# EAGLE design 612_jetracer_328_020027 (EAGLE 9.6.2)
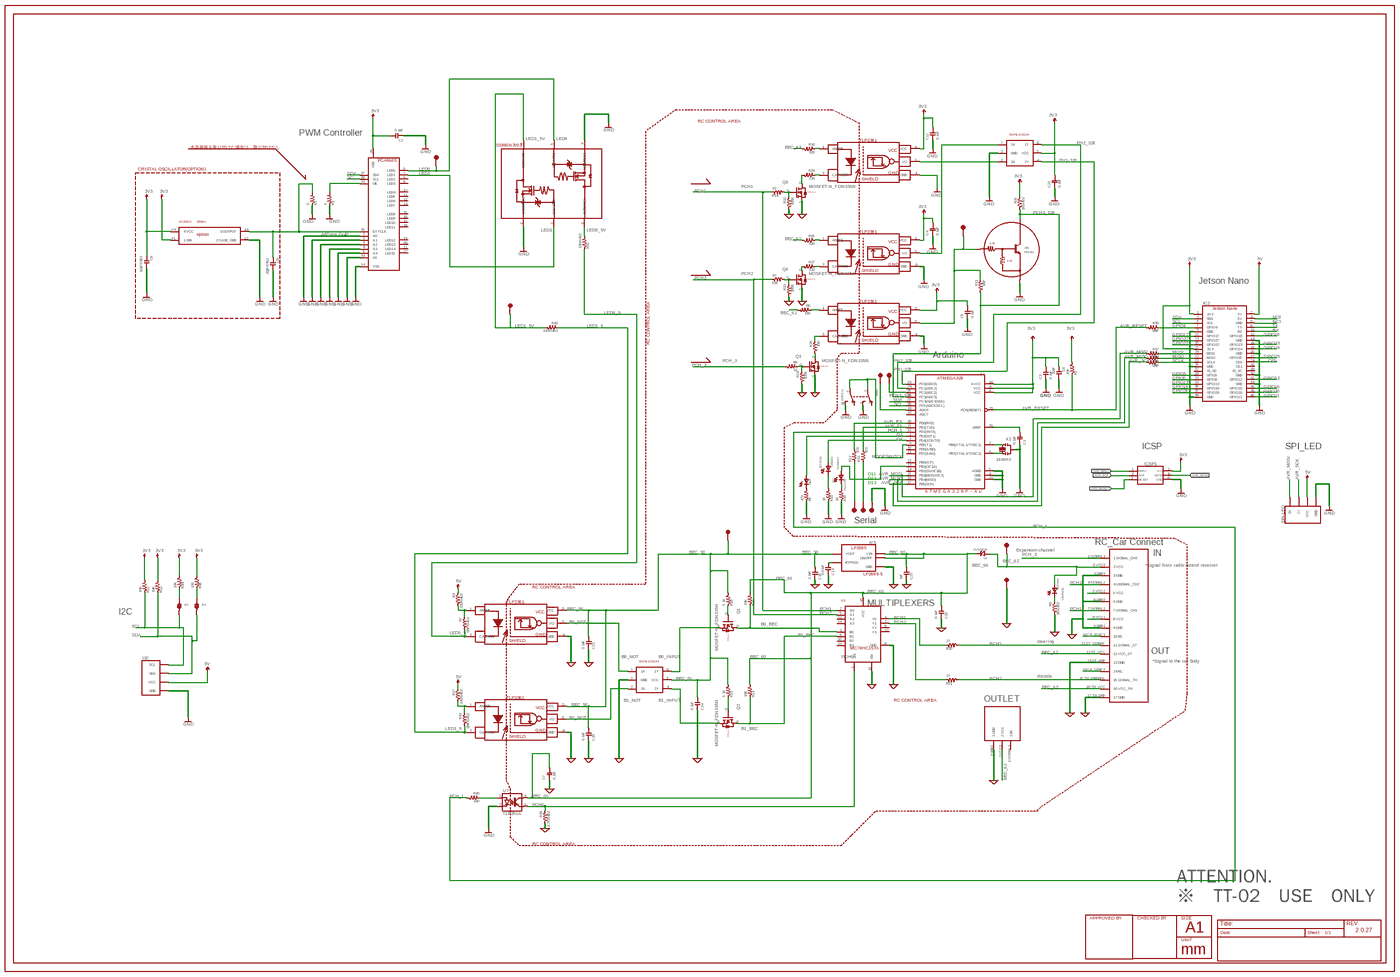
[diagram p0: schematic, sheet 1, overview]
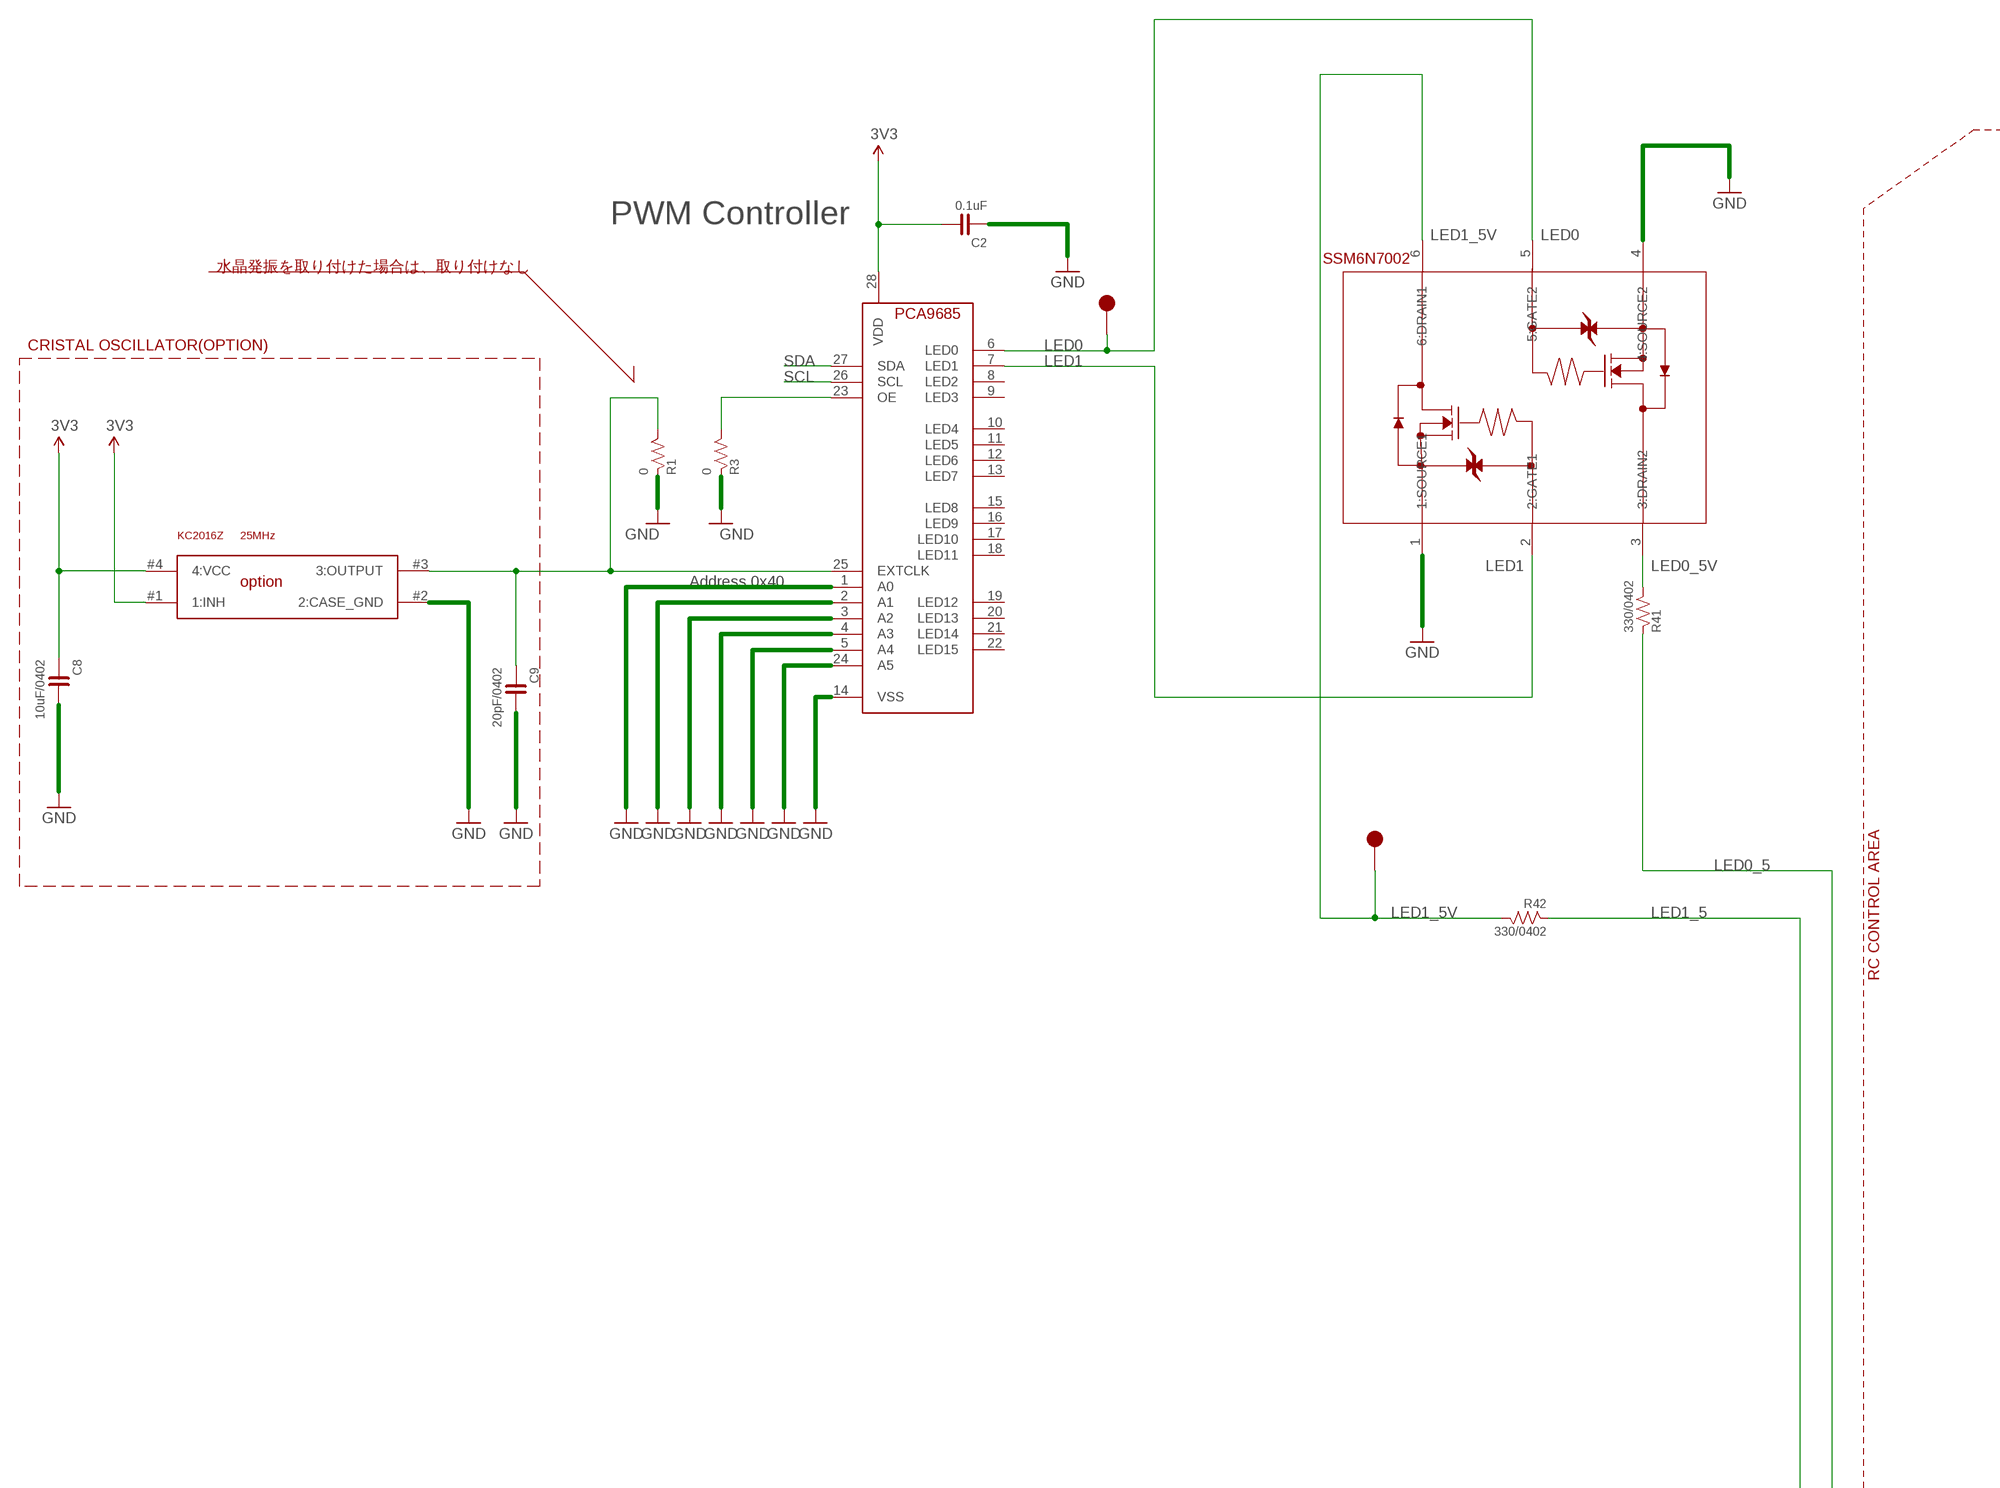
[diagram p1: schematic, sheet 1, part 1 of 4]
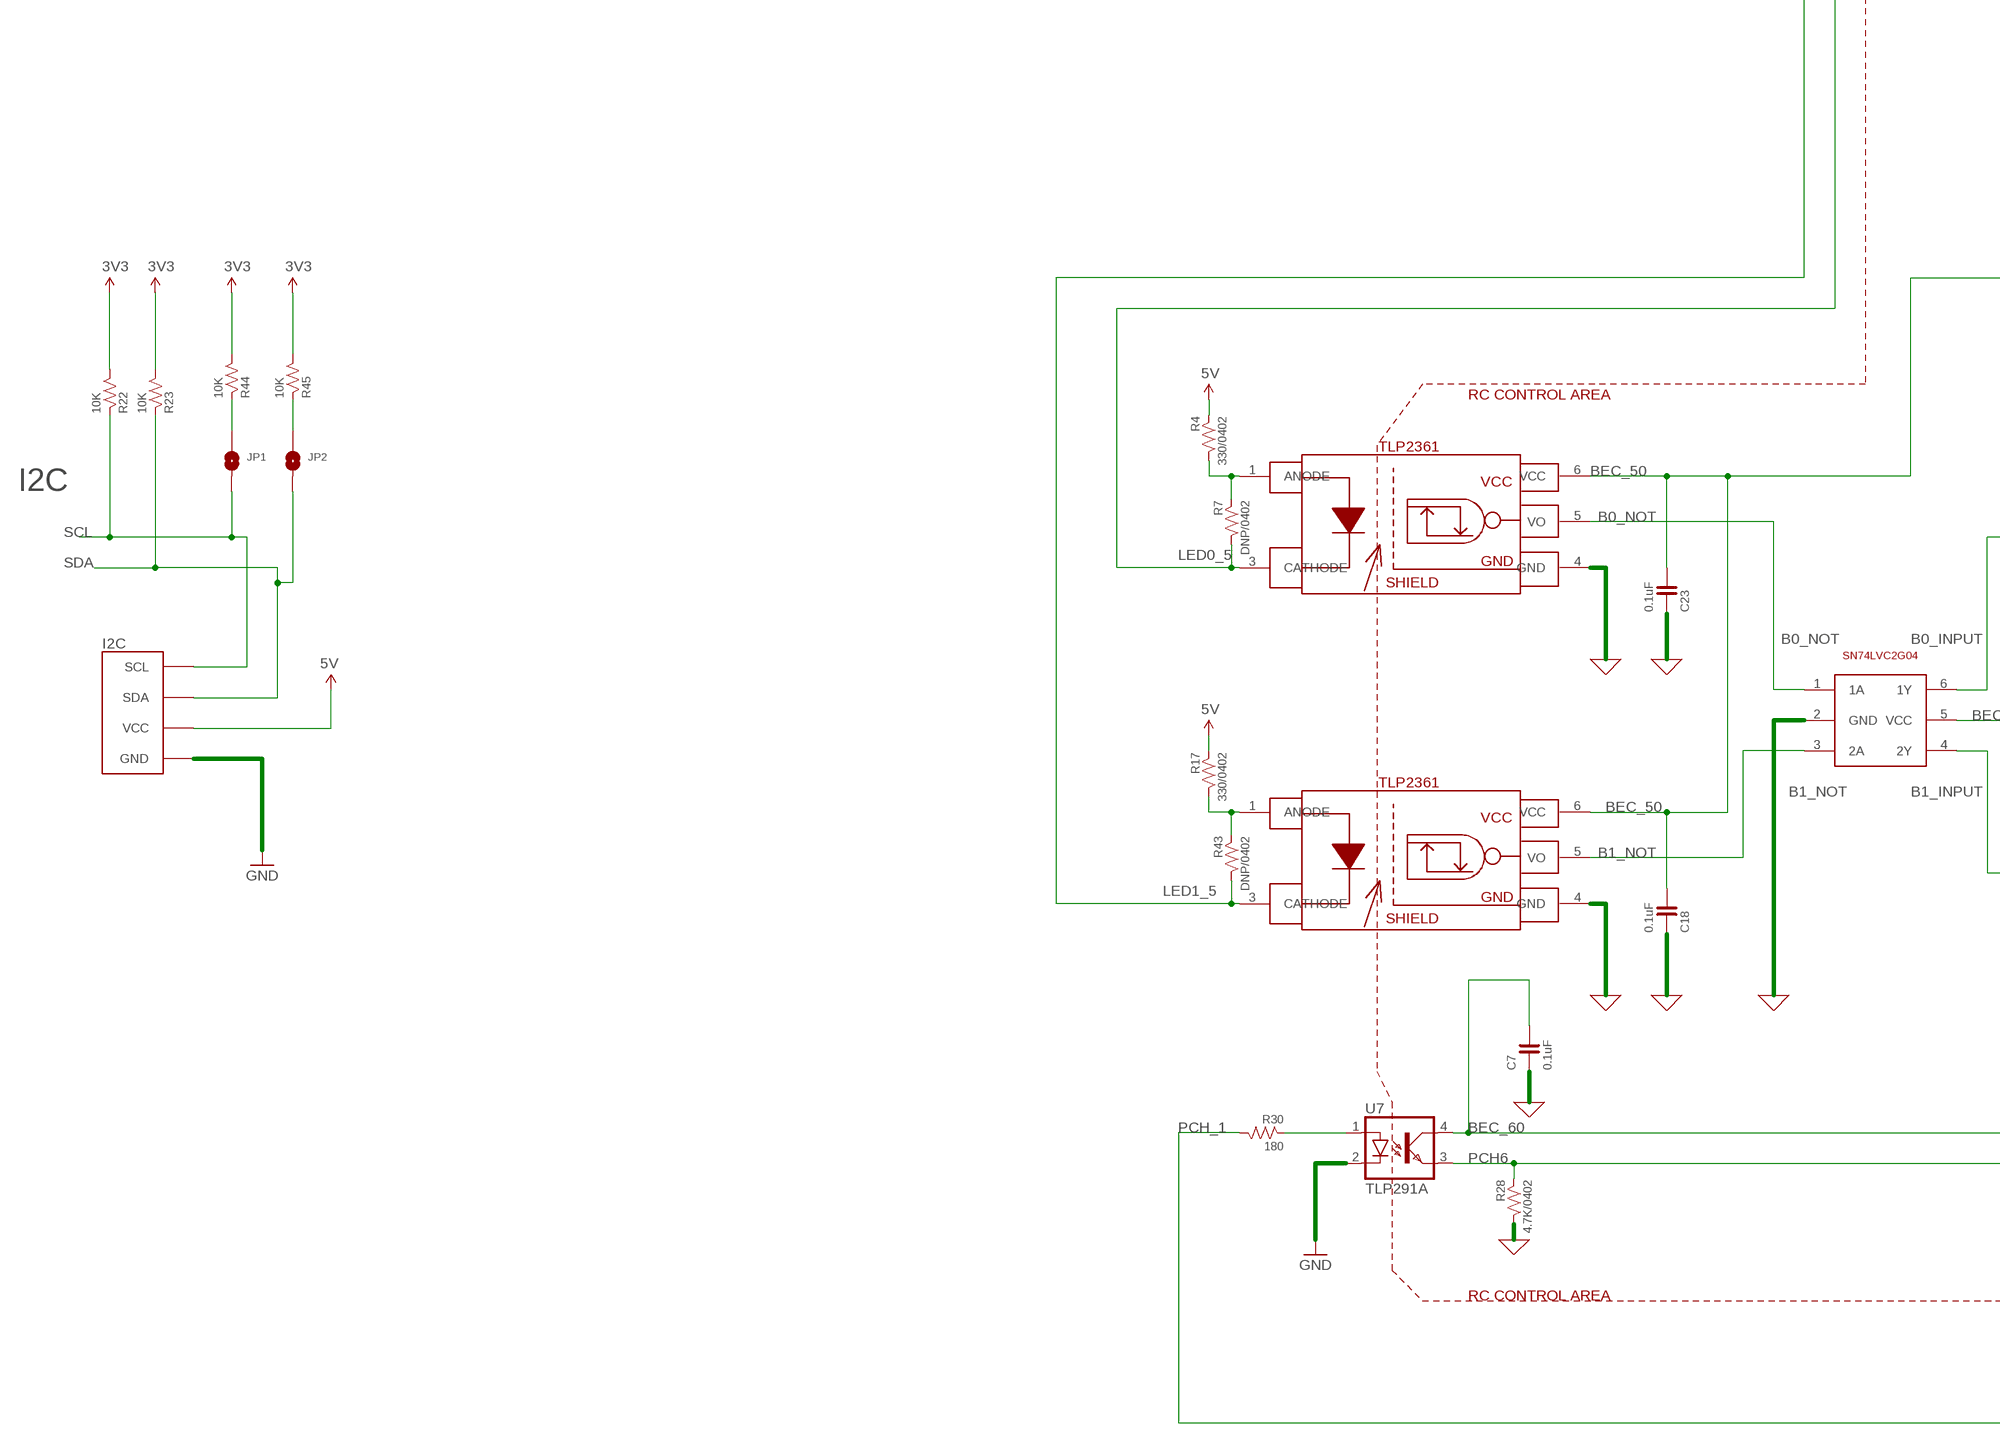
[diagram p2: schematic, sheet 1, part 2 of 4]
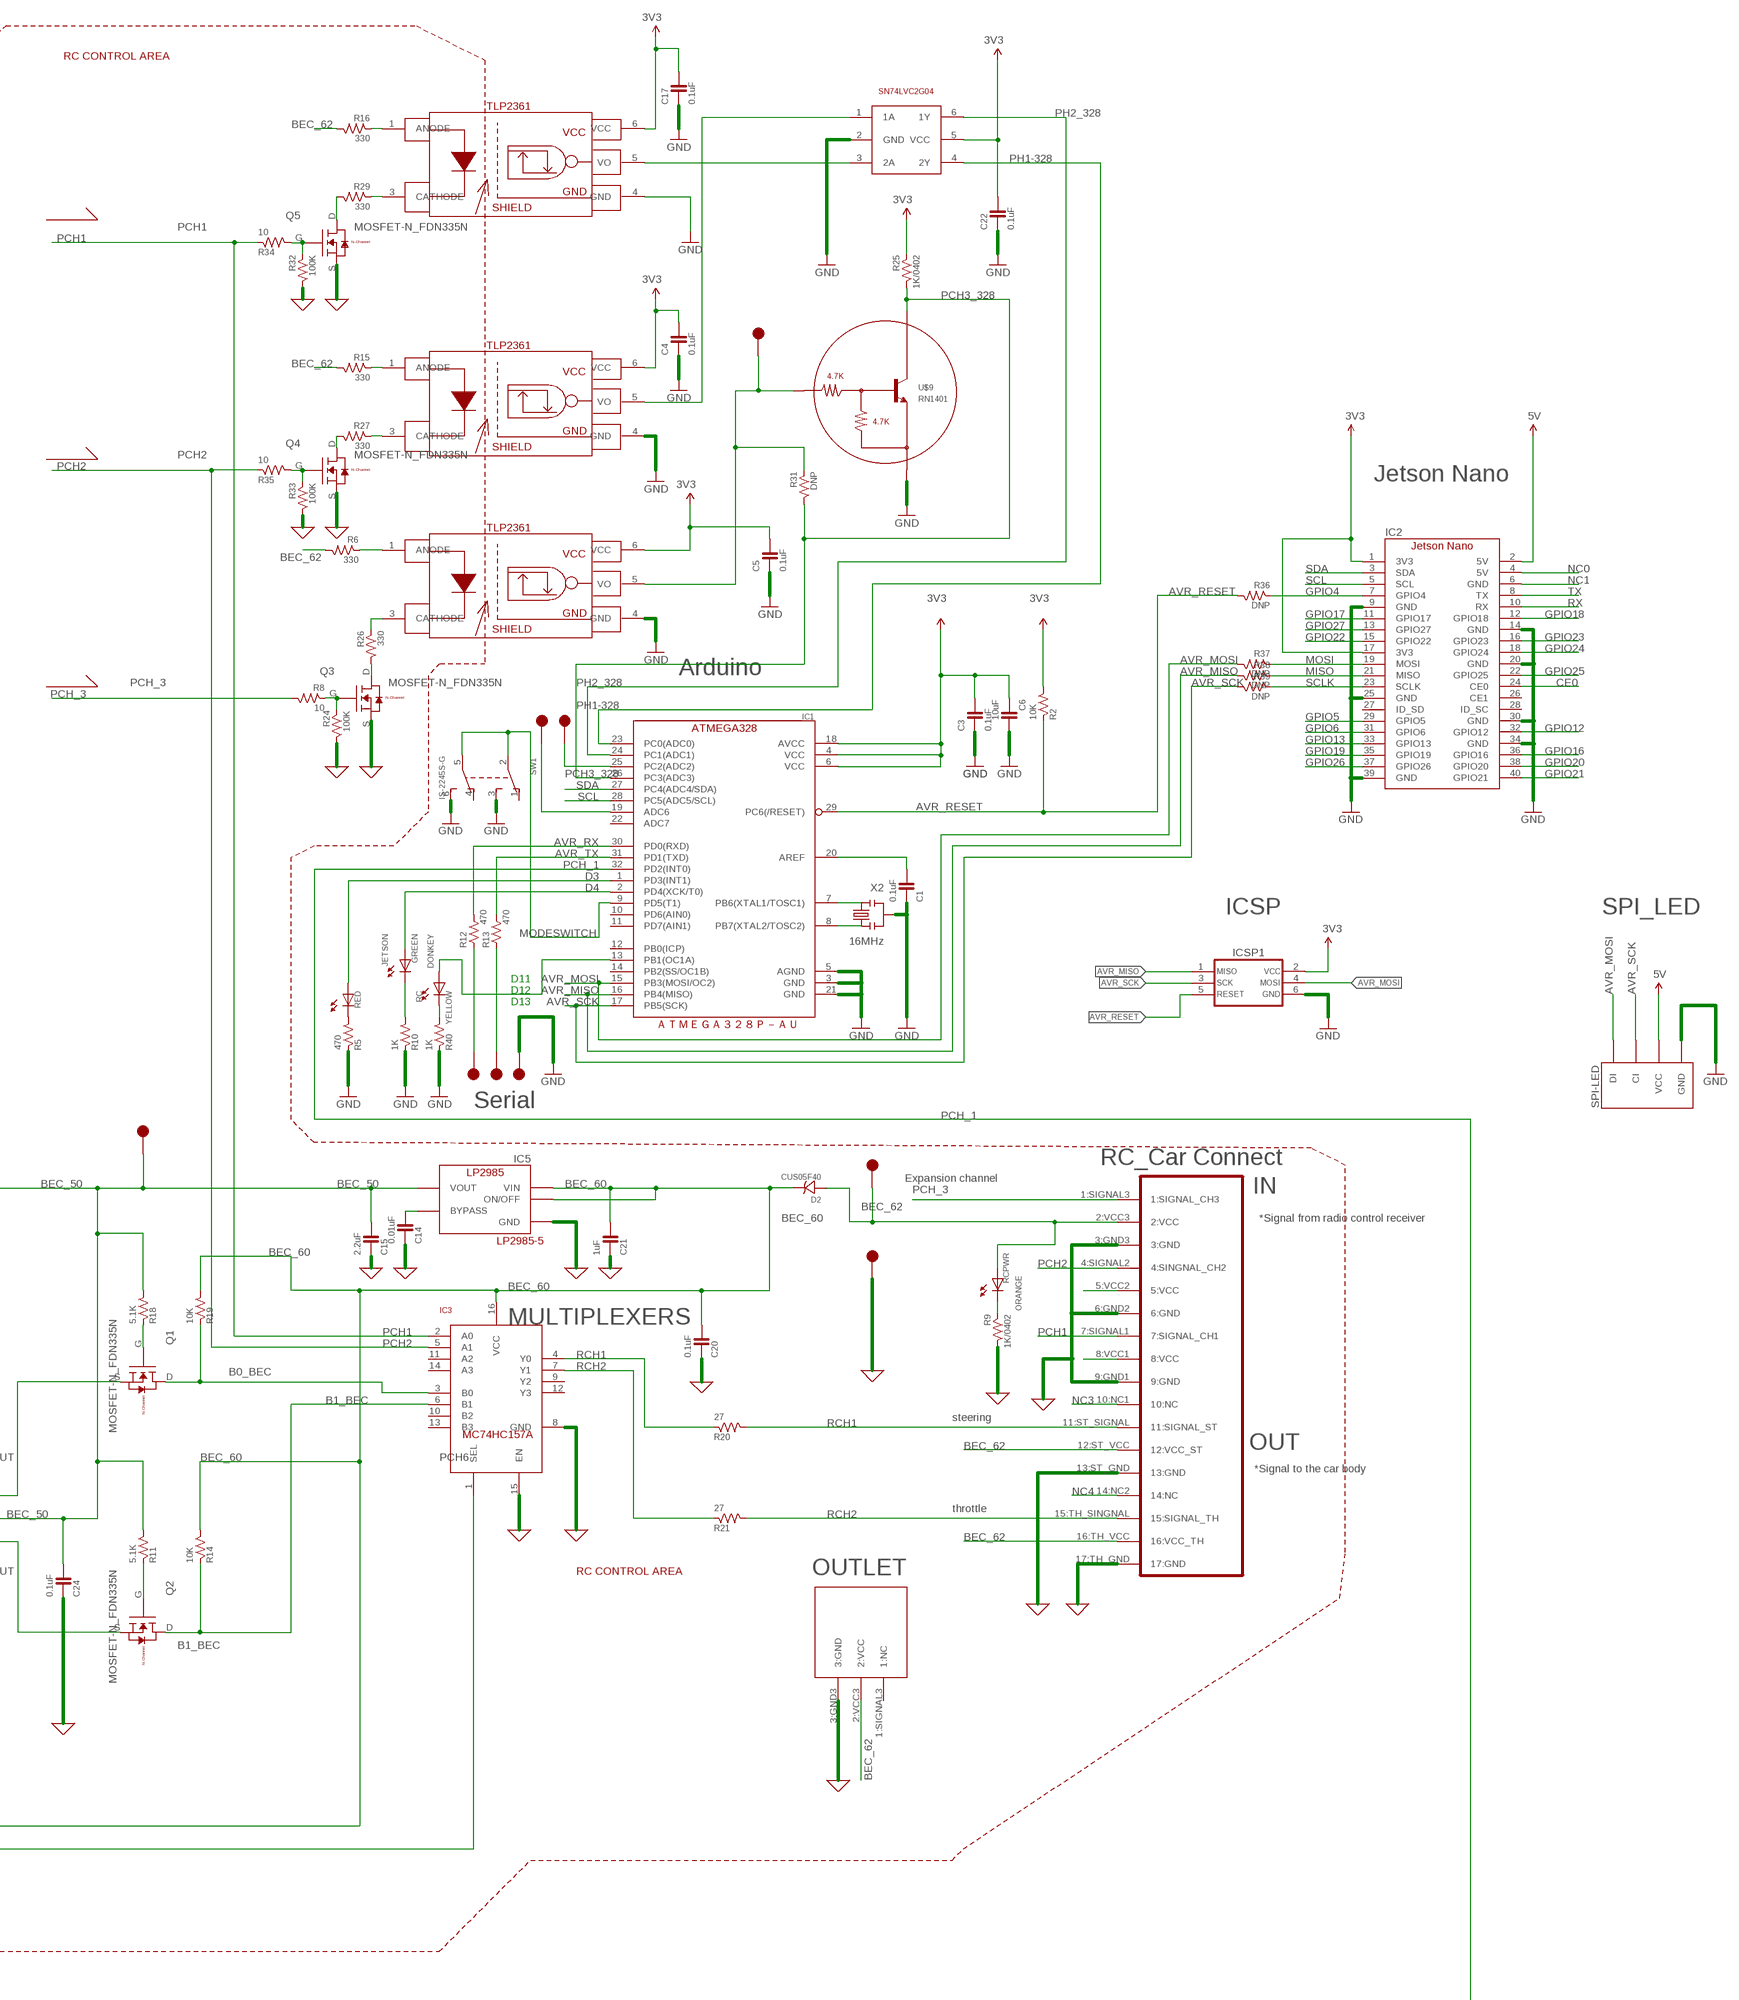
[diagram p3: schematic, sheet 1, part 3 of 4]
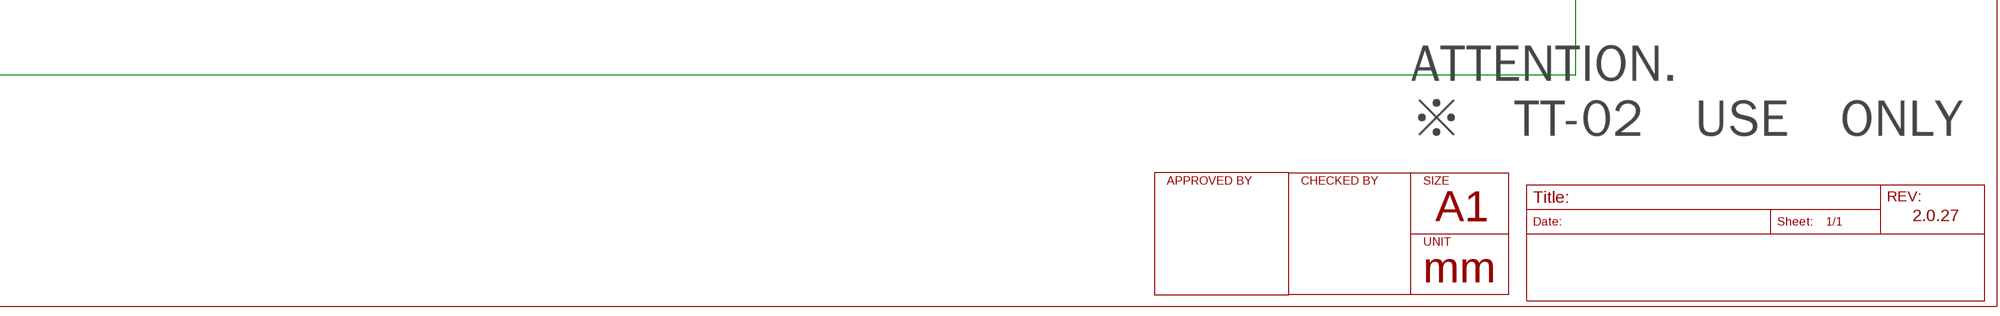
[diagram p4: schematic, sheet 1, part 4 of 4]

## Parts
ANA2  AD2  TP-15  [TP-15]
ANA6  TP-15  [TP-15]
BEC1  TP-15  [TP-15]
BEC50  TP-15  [TP-15]
BEC62TP  TP-15  [TP-15]
BEC62TP1  TP-15  [TP-15]
C1  0.1uF  CAPACITOR-0603  [0603]
C2  0.1uF  CAPACITOR-0603  [0603]
C3  0.1uF  CAPACITOR-0402  [0402]
C4  0.1uF  CAPACITOR-0402  [0402]
C5  0.1uF  CAPACITOR-0402  [0402]
C6  10uF  CAPACITOR-0603  [0603]
C7  0.1uF  CAPACITOR-0402  [0402]
C8  10uF/0402  CAPACITOR-0402  [0402]
C9  20pF/0402  CAPACITOR-0402  [0402]
C14  0.01uF  CAPACITOR-0603  [0603]
C15  2.2uF  CAPACITOR-0603  [0603]
C17  0.1uF  CAPACITOR-0603  [0603]
C18  0.1uF  CAPACITOR-0603  [0603]
C20  0.1uF  CAPACITOR-0603  [0603]
C21  1uF  CAPACITOR-0603  [0603]
C22  0.1uF  CAPACITOR-0402  [0402]
C23  0.1uF  CAPACITOR-0603  [0603]
C24  0.1uF  CAPACITOR-0603  [0603]
D2  CUS05F40  [CUS05F40]
DONKEY  YELLOW  LED-0603  [0603]
I2C  FABO-I2C  [I2C-SM04B-PASS-1-FL]
IC1  ATMEGA328P-AU  [TQFP-32]
IC2  JETSON_NANO_NOBORDER  [JETSON_NANO_NOBOARDER]
IC3  MULTIPLEXERSMC74HC157A  [TSSOP-16]
IC4  PCA9685_BOTTOM  [PCA9685_BOTTOM]
IC5  LP2985-33DBV  [SOT-23-5]
ICSP1  ICSP_AVR-TC_NOHOLE  [TC2030]
JETSON  GREEN  LED-0603  [0603]
JP1  FABO-SMD-JUMPER-SELECT-NARROW  [SMD-JUMPER_SELECT_NARROW]
JP2  FABO-SMD-JUMPER-SELECT-NARROW  [SMD-JUMPER_SELECT_NARROW]
LED0TP  TP-15  [TP-15]
LED1TP  TP-15  [TP-15]
Q1  MOSFET-N_FDN335N  [SUPERSOT-3]
Q2  MOSFET-N_FDN335N  [SUPERSOT-3]
Q3  MOSFET-N_FDN335N  [SUPERSOT-3]
Q4  MOSFET-N_FDN335N  [SUPERSOT-3]
Q5  MOSFET-N_FDN335N  [SUPERSOT-3]
R1  0  RESISTOR-0603  [0603]
R2  10K  RESISTOR-0603  [0603]
R3  0  RESISTOR-0603  [0603]
R4  330/0402  RESISTOR-0402  [0402]
R5  470  RESISTOR-0603  [0603]
R6  330  RESISTOR-0603  [0603]
R7  DNP/0402  RESISTOR-0402  [0402]
R8  10  RESISTOR-0603  [0603]
R9  1K/0402  RESISTOR-0402  [0402]
R10  1K  RESISTOR-0603  [0603]
R11  5.1K  RESISTOR-0603  [0603]
R12  470  RESISTOR-0603  [0603]
R13  470  RESISTOR-0603  [0603]
R14  10K  RESISTOR-0603  [0603]
R15  330  RESISTOR-0603  [0603]
R16  330  RESISTOR-0603  [0603]
R17  330/0402  RESISTOR-0402  [0402]
R18  5.1K  RESISTOR-0603  [0603]
R19  10K  RESISTOR-0603  [0603]
R20  27  RESISTOR-0603  [0603]
R21  27  RESISTOR-0603  [0603]
R22  10K  RESISTOR-0603  [0603]
R23  10K  RESISTOR-0603  [0603]
R24  100K  RESISTOR-0603  [0603]
R25  1K/0402  RESISTOR-0402  [0402]
R26  330  RESISTOR-0603  [0603]
R27  330  RESISTOR-0603  [0603]
R28  4.7K/0402  RESISTOR-0402  [0402]
R29  330  RESISTOR-0603  [0603]
R30  180  RESISTOR-0603  [0603]
R31  DNP  RESISTOR-0402  [0402]
R32  100K  RESISTOR-0603  [0603]
R33  100K  RESISTOR-0603  [0603]
R34  10  RESISTOR-0603  [0603]
R35  10  RESISTOR-0603  [0603]
R36  DNP  RESISTOR-0603  [0603]
R37  DNP  RESISTOR-0603  [0603]
R38  DNP  RESISTOR-0603  [0603]
R39  DNP  RESISTOR-0603  [0603]
R40  1K  RESISTOR-0603  [0603]
R41  330/0402  RESISTOR-0402  [0402]
R42  330/0402  RESISTOR-0402  [0402]
R43  DNP/0402  RESISTOR-0402  [0402]
R44  10K  RESISTOR-0603  [0603]
R45  10K  RESISTOR-0603  [0603]
RC  RED  LED-0603  [0603]
RCPWR  ORANGE  LED-0603  [0603]
SPI-LED  FABO-SPI-LED  [SPI-SM04B-PASS-1-FL]
SW1  IS-2245S-G  [IS-2245S-G]
T5  SN74LVC2G04  [SOT-23-6]
T6  SN74LVC2G04  [SOT-23-6]
TP1  TP-15  [TP-15]
TP2  TP-15  [TP-15]
TP3  TP-15  [TP-15]
U1  TLP2361  [TLP2361]
U7  TLP291A  [11-3C1]
U8  TLP2361  [TLP2361]
U9  TLP2361  [TLP2361]
U10  TLP2361  [TLP2361]
U11  TLP2361  [TLP2361]
U$1  RC_17PIN_OUTIN  [PNHEADER_2.54_SMT_17PIN_RC_TT01_02]
U$3  RC_3PIN_POWEROUT  [PNHEADER_2.54_SMT_3PIN_RC_TT01_02]
U$9  RN1401  [SC-59]
U$10  SSM6N7002KFU  [US6]
U$11  KC2016Z  [KC2016Z]
X2  16MHz  RESONATOR  [CSTNE_V_C]

## Nets
0: BEC62TP1.1 C7.1 C14.1 C15.1 C18.1 C20.1 C21.1 C23.1 C24.1 IC3.8(GND) IC3.15(EN) IC5.2(GND) Q3.S Q4.S Q5.S R9.2 R24.2 R28.2 R32.2 R33.2 T6.2(GND) U10.4(GND) U11.4(GND) U$1.3:GND3(3:GND) U$1.6:GND2(6:GND) U$1.9:GND1(9:GND) U$1.13:ST_GND(13:GND) U$1.17:TH_GND(17:GND) U$3.3:GND3(3:GND) ; supply symbol labelled GND
3V3: C2.2 C3.2 C4.2 C5.2 C6.1 C8.1 C17.2 C22.2 IC1.4(VCC) IC1.6(VCC) IC1.18(AVCC) IC2.1(3V3) IC2.17(3V3) IC4.28(VDD) ICSP1.2 R2.2 R22.2 R23.2 R25.1 R44.2 R45.2 T5.5(VCC) U1.6(VCC) U8.6(VCC) U9.6(VCC) U$11.#1(1:INH) U$11.#4(4:VCC)
5V: I2C.5V(VCC) IC2.2(5V) R4.1 R17.1 SPI-LED.5V(VCC)
AD2: ANA2.1 IC1.25(PC2(ADC2))
AD6: ANA6.1 IC1.19(ADC6)
AVR_MISO: IC1.16(PB4(MISO)) ICSP1.1 R38.2
AVR_MOSI: IC1.15(PB3(MOSI/OC2)) ICSP1.4 R37.2 SPI-LED.DI
AVR_RESET: IC1.29(PC6(/RESET)) ICSP1.5 R2.1 R36.2
AVR_RX: IC1.30(PD0(RXD)) R12.2
AVR_SCK: IC1.17(PB5(SCK)) ICSP1.3 R39.2 SPI-LED.CI
AVR_TX: IC1.31(PD1(TXD)) R13.2
B0_BEC: IC3.3(B0) Q1.D R19.1
B0_INPUT: Q1.S T6.6(1Y)
B0_NOT: T6.1(1A) U10.5(VO)
B1_BEC: IC3.6(B1) Q2.D R14.1
B1_INPUT: Q2.S T6.4(2Y)
B1_NOT: T6.3(2A) U11.5(VO)
BEC_50: BEC50.1 C15.2 C18.2 C23.2 C24.2 IC5.5(VOUT) R11.2 R18.2 T6.5(VCC) U10.6(VCC) U11.6(VCC)
BEC_60: C7.2 C20.2 C21.2 D2.C(CATHODE) IC3.16(VCC) IC5.1(VIN) IC5.3(ON/OFF) R14.2 R19.2 U7.4(COL)
BEC_62: BEC62TP.1 D2.A(ANODE) R6.2 R15.2 R16.2 RCPWR.ANODE U$1.2:VCC3(2:VCC) U$1.5:VCC2(5:VCC) U$1.8:VCC1(8:VCC) U$1.12:ST_VCC(12:VCC_ST) U$1.16:TH_VCC(16:VCC_TH) U$3.2:VCC3(2:VCC)
CE0: IC2.24(CE0)
D3: IC1.1(PD3(INT1)) RC.ANODE
D4: IC1.2(PD4(XCK/T0)) JETSON.ANODE
GND: C1.1 C2.1 C3.1 C4.1 C5.1 C6.2 C8.2 C9.2 C17.1 C22.1 I2C.GND IC1.3(GND) IC1.5(AGND) IC1.21(GND) IC2.9(GND) IC2.14(GND) IC2.20(GND) IC2.25(GND) IC2.30(GND) IC2.34(GND) IC2.39(GND) IC4.1(A0) IC4.2(A1) IC4.3(A2) IC4.4(A3) IC4.5(A4) IC4.14(VSS) IC4.24(A5) ICSP1.6 R1.1 R3.1 R5.1 R10.1 R40.1 SPI-LED.GND SW1.3 SW1.6 T5.2(GND) TP3.1 U1.4(GND) U7.2(C) U8.4(GND) U9.4(GND) U$9.E U$10.1(1:SOURCE1) U$10.4(4:SOURCE2) U$11.#2(2:CASE_GND) X2.2
GPIO4: IC2.7(GPIO4) R36.1
GPIO5: IC2.29(GPIO5)
GPIO6: IC2.31(GPIO6)
GPIO12: IC2.32(GPIO12)
GPIO13: IC2.33(GPIO13)
GPIO16: IC2.36(GPIO16)
GPIO17: IC2.11(GPIO17)
GPIO18: IC2.12(GPIO18)
GPIO19: IC2.35(GPIO19)
GPIO20: IC2.38(GPIO20)
GPIO21: IC2.40(GPIO21)
GPIO22: IC2.15(GPIO22)
GPIO23: IC2.16(GPIO23)
GPIO24: IC2.18(GPIO24)
GPIO25: IC2.22(GPIO25)
GPIO26: IC2.37(GPIO26)
GPIO27: IC2.13(GPIO27)
LED0: IC4.6(LED0) LED0TP.1 U$10.5(5:GATE2)
LED0_5: R7.2 R41.1 U10.3(CATHODE)
LED0_5V: R41.2 U$10.3(3:DRAIN2)
LED1: IC4.7(LED1) U$10.2(2:GATE1)
LED1_5: R42.1 R43.2 U11.3(CATHODE)
LED1_5V: LED1TP.1 R42.2 U$10.6(6:DRAIN1)
MISO: IC2.21(MISO) R38.1
MODESWITCH: IC1.9(PD5(T1)) SW1.2 SW1.5
MOSI: IC2.19(MOSI) R37.1
N$2: R4.2 R7.1 U10.1(ANODE)
N$3: JP1.1 R44.1
N$4: C1.2 IC1.20(AREF)
N$5: IC1.8(PB7(XTAL2/TOSC2)) X2.3
N$6: R12.1 TP1.1
N$7: IC4.23(OE) R3.2
N$8: DONKEY.ANODE IC1.13(PB1(OC1A))
N$9: R15.1 U9.1(ANODE)
N$10: T5.1(1A) U9.5(VO)
N$11: T5.3(2A) U8.5(VO)
N$12: R16.1 U8.1(ANODE)
N$13: R17.2 R43.1 U11.1(ANODE)
N$14: JP2.1 R45.1
N$15: IC1.7(PB6(XTAL1/TOSC1)) X2.1
N$17: R13.1 TP2.1
N$19: R5.2 RC.CATHODE
N$20: JETSON.CATHODE R10.2
N$21: R26.1 U1.3(CATHODE)
N$22: R6.1 U1.1(ANODE)
N$23: Q3.G R8.1 R24.1
N$24: R9.1 RCPWR.CATHODE
N$25: BEC1.1 R31.1 U1.5(VO) U$9.B
N$26: Q3.D R26.2
N$27: Q4.D R27.2
N$28: R27.1 U9.3(CATHODE)
N$29: Q5.D R29.2
N$30: R29.1 U8.3(CATHODE)
N$31: C14.2 IC5.4(BYPASS)
N$33: Q5.G R32.1 R34.2
N$35: R21.2 U$1.15:TH_SINGNAL(15:SIGNAL_TH)
N$36: R20.2 U$1.11:ST_SIGNAL(11:SIGNAL_ST)
N$38: Q4.G R33.1 R35.2
N$39: Q2.G R11.1
N$40: Q1.G R18.1
N$41: C9.1 IC4.25(EXTCLK) R1.2 U$11.#3(3:OUTPUT)
N$43: R30.1 U7.1(A)
N$44: DONKEY.CATHODE R40.2
NC0: IC2.4(5V)
NC1: IC2.6(GND)
NC3: U$1.10:NC1(10:NC)
NC4: U$1.14:NC2(14:NC)
PCH1: IC3.2(A0) R34.1 U$1.7:SIGNAL1(7:SIGNAL_CH1)
PCH2: IC3.5(A1) R35.1 U$1.4:SIGNAL2(4:SINGNAL_CH2)
PCH3_328: IC1.26(PC3(ADC3)) R25.2 R31.2 U$9.C
PCH6: IC3.1(SEL) R28.1 U7.3(EMI)
PCH_1: IC1.32(PD2(INT0)) R30.2
PCH_3: R8.2 U$1.1:SIGNAL3(1:SIGNAL_CH3)
PH1-328: IC1.23(PC0(ADC0)) T5.4(2Y)
PH2_328: IC1.24(PC1(ADC1)) T5.6(1Y)
RCH1: IC3.4(Y0) R20.1
RCH2: IC3.7(Y1) R21.1
RX: IC2.10(RX)
SCL: I2C.SCL IC1.28(PC5(ADC5/SCL)) IC2.5(SCL) IC4.26(SCL) JP1.2 R22.1
SCLK: IC2.23(SCLK) R39.1
SDA: I2C.SDA IC1.27(PC4(ADC4/SDA)) IC2.3(SDA) IC4.27(SDA) JP2.2 R23.1
TX: IC2.8(TX)
Unconnected: IC1.10(PD6(AIN0)) IC1.11(PD7(AIN1)) IC1.12(PB0(ICP)) IC1.14(PB2(SS/OC1B)) IC1.22(ADC7) IC2.26(CE1) IC2.27(ID_SD) IC2.28(ID_SC) IC3.9(Y2) IC3.10(B2) IC3.11(A2) IC3.12(Y3) IC3.13(B3) IC3.14(A3) IC4.8(LED2) IC4.9(LED3) IC4.10(LED4) IC4.11(LED5) IC4.12(LED6) IC4.13(LED7) IC4.15(LED8) IC4.16(LED9) IC4.17(LED10) IC4.18(LED11) IC4.19(LED12) IC4.20(LED13) IC4.21(LED14) IC4.22(LED15) SW1.1 SW1.4 U$3.1:SIGNAL3(1:NC)

## Notes on the sheet
- RC CONTROL AREA
- PWM Controller
- 水晶発振を取り付けた場合は、取り付けなし
- CRISTAL OSCILLATOR(OPTION)
- option | Address 0x40
- Jetson Nano
- RC CONTROL AREA
- Arduino
- ICSP | SPI_LED
- D11
- D12
- D13
- ＡＴＭＥＧＡ３２８Ｐ－ＡＵ
- Serial
- RC_Car Connect
- Expansion channel
- IN
- *Signal from radio control receiver
- LP2985-5
- RC CONTROL AREA
- MULTIPLEXERS
- I2C
- steering
- MC74HC157A
- OUT
- *Signal to the car body
- throttle
- RC CONTROL AREA | OUTLET
- RC CONTROL AREA
- ATTENTION.
  ※　TT-02　USE　ONLY
- 2.0.27

## Library data of the parts
ANA2 ANA6 BEC1 BEC50 BEC62TP BEC62TP1 LED0TP LED1TP TP1-TP3 = FaBo-Supply:TP
C1-C9 C14 C15 C17 C20-C22 = FaBo-Capacitor:CAPACITOR: CAPACITOR
C18 C23 C24 = FaBo-Capacitor:CAPACITOR: CAPACITOR; SPICEPREFIX: C
D2 = FaBo-Diode:CUS05F40
DONKEY JETSON RC RCPWR = FaBo-LED:LED
I2C = FaBo-Connetor:FABO-I2C
IC1 = component:ATMEGA328
IC2 = FaBo-Boards:JETSON_NANO
IC3 = FaBo-Multiplexers:MULTIPLEXERS
IC4 = FaBo-Motor:PCA9685
IC5 = FaBo-Supply:LP2985: LP2985
ICSP1 = component:ICSP_AVR
JP1 JP2 = FaBo-PIN:FABO-SMD-JUMPER-SELECT-NARROW
Q1-Q5 = FaBo-Mosfet:MOSFET-N
R1-R45 = FaBo-Resistors:RESISTOR: RESISTOR
SPI-LED = FaBo-Connetor:FABO-SPI-LED
SW1 = FaBo-Switch:IS-2245S-G
T5 T6 = FaBo-Transistor:SN74LVC2G04
U1 U8-U11 = FaBo-etc:TLP2361
U7 = FaBo_Photocoupler:TLP291A
U$1 = FaBo-PIN:RC_17PIN_OUTIN
U$3 = FaBo-PIN:RC_3PIN_POWEROUT
U$9 = FaBo-Transistor:RN1401
U$10 = FaBo-Mosfet:SSM6N7002KFU
U$11 = FaBo-Crystal:KC2016Z
X2 = component:RESONATOR

## Board
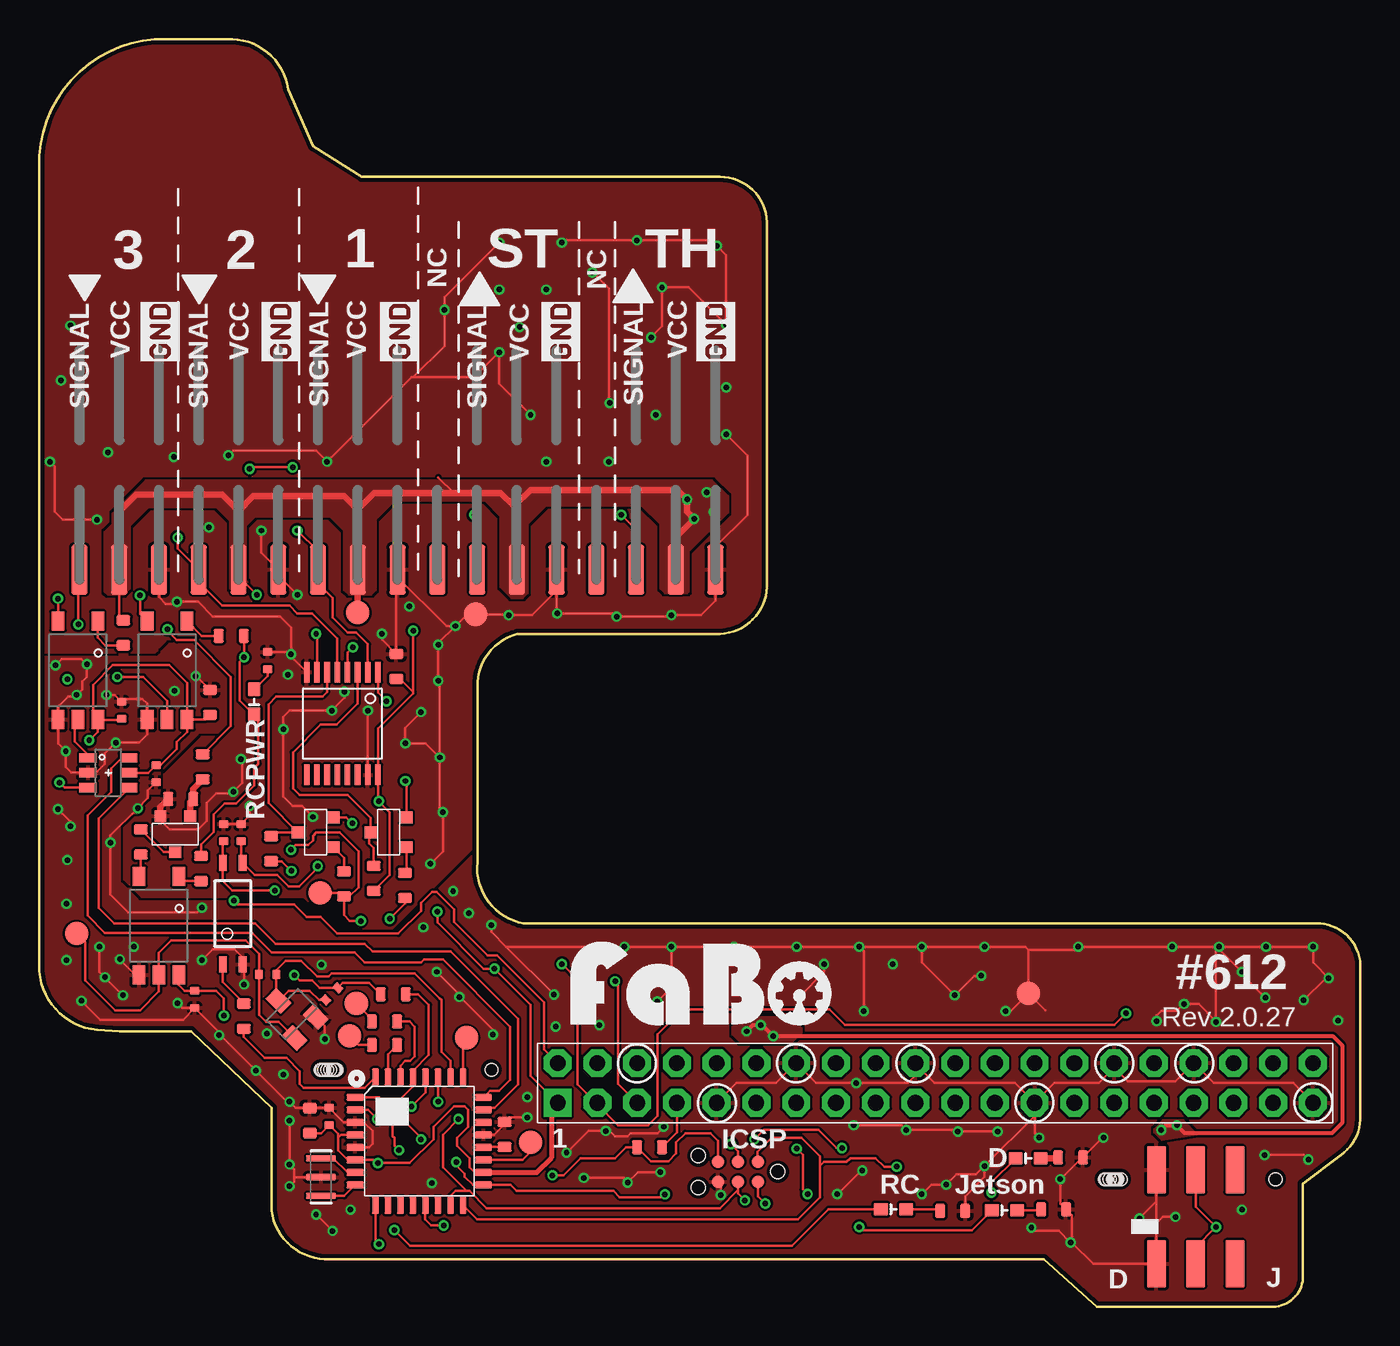
[diagram p5: board, top side]
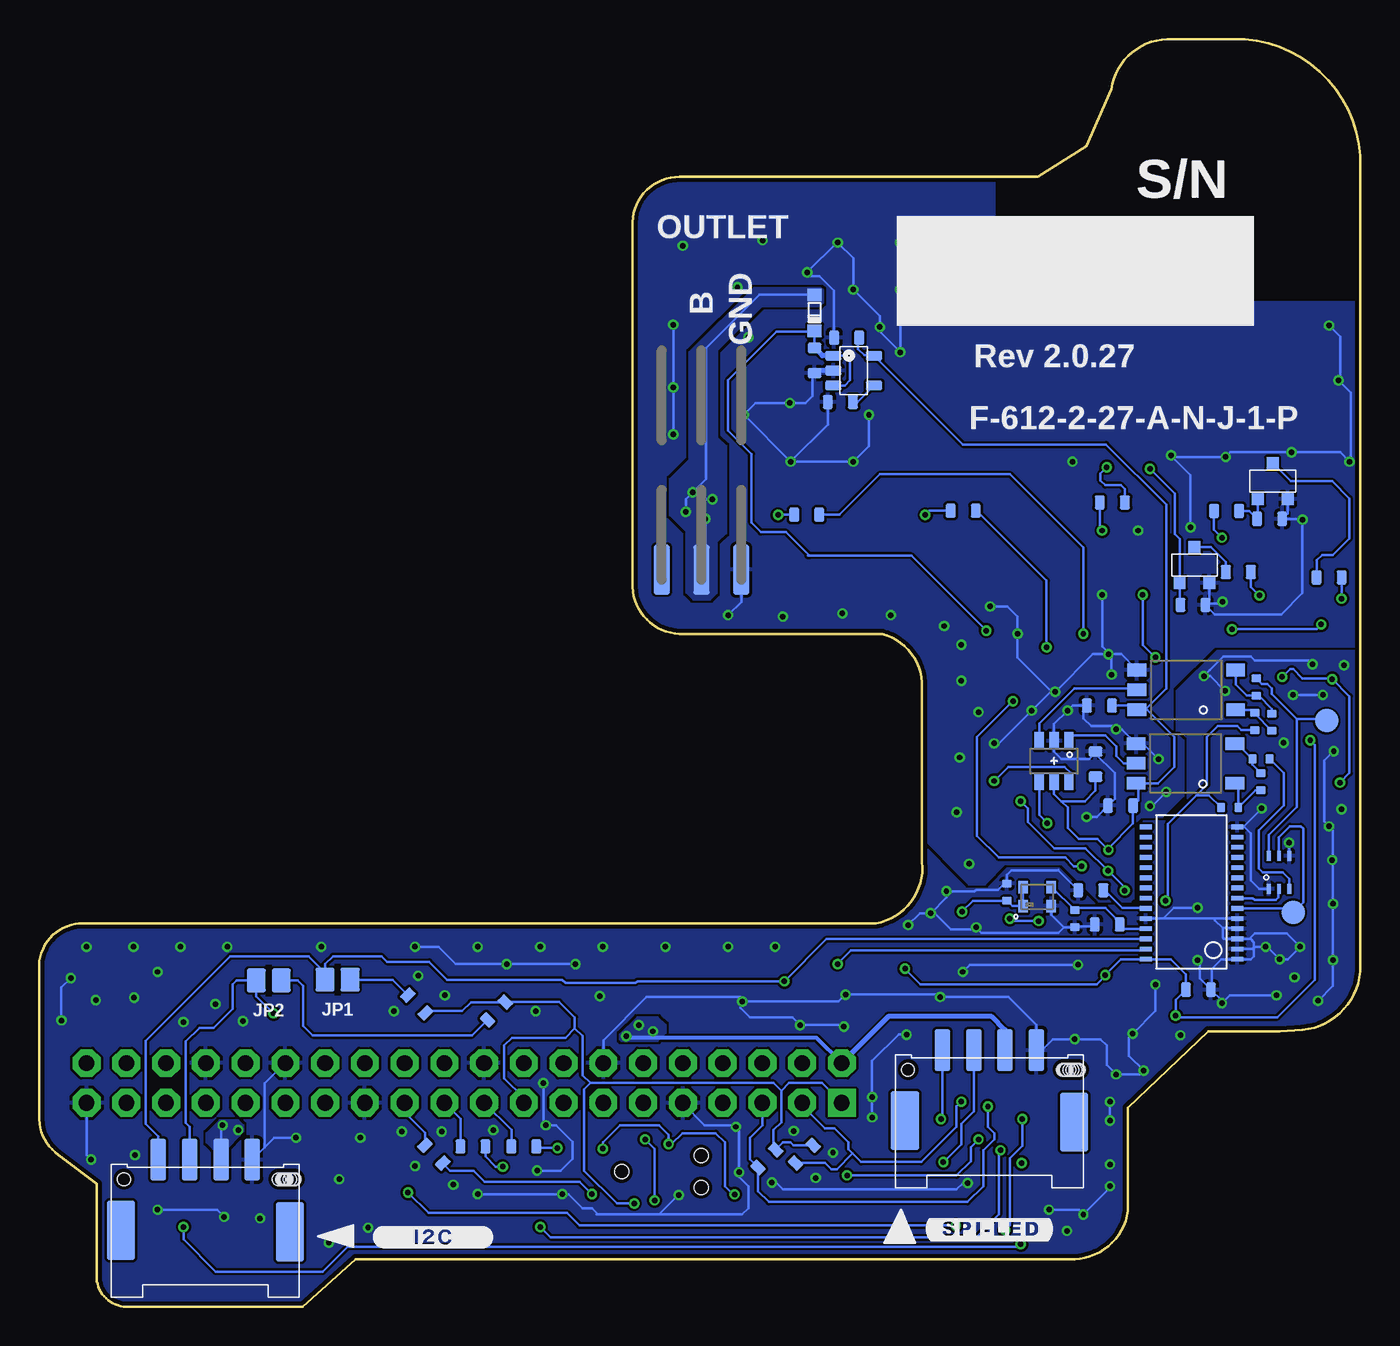
[diagram p6: board, bottom side, seen from below]

Size 84.42 x 81 mm. Coordinates in mm from the lower left corner, seen from the top.
Outline: 0,21.8 0,72.8 arc-93 8.15,81 12.35,81 arc-80 15.9,77.8 17.5,74.15 20.6,72.2 43.5,72.2 arc-89 46.5,69.3 46.5,46 arc-86 43.5,43 30.55,43 arc71 28,39.9 28,28.4 arc85 30.95,24.5 81.85,24.5 arc-78 84.4,22.1 84.4,12.5 arc-61 83.2,9.7 80.75,7.85 80.75,2 arc-90 78.85,0 67.6,0 64.2,3.05 18.25,3.05 arc-80 14.85,6.15 14.85,12.7 9.7,17.6 5.15,17.6 3.7,17.7 arc-85 0,21.8
Copper layers (1*16): Top 0.035mm / dielectric 1.6mm / Bottom 0.035mm
Design rules "PCBway": minimum track width 6mil, minimum drill 12mil, track to track 6mil, track to pad 6mil, pad to pad 6mil, via to via 6mil, smd to smd 6mil, copper to edge 10mil, drill to drill 10mil, minimum pad ring 10mil, minimum via ring 6mil, stop-mask expansion 2mil, vias tented up to drill 100mil, thermal gap 8mil
tRestrict: 2 lines
bRestrict: area -1.2,64.3 to 23.3,85.5

### Footprints (pad centres in the part's own frame; a part is rotated, then mirrored left to right if it is on the bottom)
TP-15 = smd 1.5 x 1.5: 1 0,0
0603 = smd 0.65 x 0.9: 1 -0.8,0; 2 0.8,0
0402 = smd 0.5 x 0.6: 1 -0.55,0; 2 0.55,0
CUS05F40 = smd 0.8 x 0.9: A -1.15,0; C 1.15,0
0603' = smd 0.9 x 0.8: ANODE -0.8,0; CATHODE 0.8,0
I2C-SM04B-PASS-1-FL = smd 1 x 2.7: 5V -1,0; GND -3,0; SCL 3,0; SDA 1,0 | smd 1.8 x 3.8: P$5 -5.4,4.6; P$6 5.4,4.5 | hole 0.8: 5.2,1.25; -4.7,1.25; -5.7,1.25; -5.6,1.25; -5.4,1.25; -5.2,1.25; -5.1,1.25; -5,1.25; -4.9,1.25
TQFP-32 = smd 1.1 x 0.45: 1 -4.1,2.8; 2 -4.1,2; 3 -4.1,1.2; 4 -4.1,0.4; 5 -4.1,-0.4; 6 -4.1,-1.2; 7 -4.1,-2; 8 -4.1,-2.8; 17 4.1,-2.8; 18 4.1,-2; 19 4.1,-1.2; 20 4.1,-0.4; 21 4.1,0.4; 22 4.1,1.2; 23 4.1,2; 24 4.1,2.8 | smd 0.45 x 1.1: 9 -2.8,-4.1; 10 -2,-4.1; 11 -1.2,-4.1; 12 -0.4,-4.1; 13 0.4,-4.1; 14 1.2,-4.1; 15 2,-4.1; 16 2.8,-4.1; 25 2.8,4.1; 26 2,4.1; 27 1.2,4.1; 28 0.4,4.1; 29 -0.4,4.1; 30 -1.2,4.1; 31 -2,4.1; 32 -2.8,4.1
JETSON_NANO_NOBOARDER = drill 1 pad 1.778 square: 1 1.27,1.27 | drill 1 pad 1.778 octagon: 2 1.27,3.81; 3 3.81,1.27; 4 3.81,3.81; 5 6.35,1.27; 6 6.35,3.81; 7 8.89,1.27; 8 8.89,3.81; 9 11.43,1.27; 10 11.43,3.81; 11 13.97,1.27; 12 13.97,3.81; 13 16.51,1.27; 14 16.51,3.81; 15 19.05,1.27; 16 19.05,3.81; 17 21.59,1.27; 18 21.59,3.81; 19 24.13,1.27; 20 24.13,3.81; 21 26.67,1.27; 22 26.67,3.81; 23 29.21,1.27; 24 29.21,3.81; 25 31.75,1.27; 26 31.75,3.81; 27 34.29,1.27; 28 34.29,3.81; 29 36.83,1.27; 30 36.83,3.81; 31 39.37,1.27; 32 39.37,3.81; 33 41.91,1.27; 34 41.91,3.81; 35 44.45,1.27; 36 44.45,3.81; 37 46.99,1.27; 38 46.99,3.81; 39 49.53,1.27; 40 49.53,3.81
TSSOP-16 = smd 0.36 x 1.3: 1 -2.275,-3.28; 2 -1.625,-3.28; 3 -0.975,-3.28; 4 -0.325,-3.28; 5 0.325,-3.28; 6 0.975,-3.28; 7 1.625,-3.28; 8 2.275,-3.28; 9 2.275,3.28; 10 1.625,3.28; 11 0.975,3.28; 12 0.325,3.28; 13 -0.325,3.28; 14 -0.975,3.28; 15 -1.625,3.28; 16 -2.275,3.28
PCA9685_BOTTOM = smd 0.3 x 0.75 bottom: 1 4.3,-2.93; 2 3.65,-2.93; 3 3,-2.93; 4 2.35,-2.93; 5 1.7,-2.93; 6 1.05,-2.93; 7 0.4,-2.93; 8 -0.25,-2.93; 9 -0.9,-2.93; 10 -1.55,-2.93; 11 -2.2,-2.93; 12 -2.85,-2.93; 13 -3.5,-2.93; 14 -4.15,-2.93; 15 -4.15,2.92; 16 -3.5,2.92; 17 -2.85,2.92; 18 -2.2,2.92; 19 -1.55,2.92; 20 -0.9,2.92; 21 -0.25,2.92; 22 0.4,2.92; 23 1.05,2.92; 24 1.7,2.92; 25 2.35,2.92; 26 3,2.92; 27 3.65,2.92; 28 4.3,2.92
SOT-23-5 = smd 0.6 x 1.05: 1 -0.95,-1.3; 2 0,-1.3; 3 0.95,-1.3; 4 0.95,1.3; 5 -0.95,1.3
TC2030 = smd 0.787 x 0.787: 1 1.27,-0.635; 2 1.27,0.635; 3 2.54,-0.635; 4 2.54,0.635; 5 3.81,-0.635; 6 3.81,0.635 | hole 0.889: 0,0; 5.08,-1.016; 5.08,1.016
SMD-JUMPER_SELECT_NARROW = smd 1.2 x 1.5: 1 -0.8,0; 2 0.8,0
SUPERSOT-3 = smd 0.76 x 0.76: D 0,1.15; G -0.95,-1.15; S 0.95,-1.15
SPI-SM04B-PASS-1-FL = smd 1 x 2.7: 5V -1,-0.1; CI 1,-0.1; DI 3,-0.1; GND -3,-0.1 | smd 1.8 x 3.8: P$5 -5.4,4.5; P$6 5.4,4.4 | hole 0.8: 5.2,1.15; -4.7,1.15; -5.7,1.15; -4.8,1.15; -4.9,1.15; -5.1,1.15; -5.3,1.15; -5.5,1.15; -5.6,1.15
IS-2245S-G = smd 1.2 x 3: 1 -2.5,3; 2 0,3; 3 2.5,3; 4 -2.5,-3; 5 0,-3; 6 2.5,-3
SOT-23-6 = smd 0.6 x 1.1: 1 -0.95,-1.3; 2 0,-1.3; 3 0.95,-1.3; 4 0.95,1.3; 5 0,1.3; 6 -0.95,1.3
TLP2361 = smd 0.8 x 1.2: 1 -1.27,-3.15; 3 1.27,-3.15; 4 1.27,3.15; 5 0,3.15; 6 -1.27,3.15
11-3C1 = smd 1 x 0.5: 1 -3.24,0.635; 2 -3.24,-0.635; 3 3.24,-0.635; 4 3.24,0.635
PNHEADER_2.54_SMT_17PIN_RC_TT01_02 = smd 1.02 x 3.17: 1:SIGNAL3 -20.32,0; 2:VCC3 -17.78,0; 3:GND3 -15.24,0; 4:SIGNAL2 -12.7,0; 5:VCC2 -10.16,0; 6:GND2 -7.62,0; 7:SIGNAL1 -5.08,0; 8:VCC1 -2.54,0; 9:GND1 0,0; 10:NC1 2.54,0; 11:ST_SIGNAL 5.08,0; 12:ST_VCC 7.62,0; 13:ST_GND 10.16,0; 14:NC2 12.7,0; 15:TH_SINGNAL 15.24,0; 16:TH_VCC 17.78,0; 17:TH_GND 20.32,0
PNHEADER_2.54_SMT_3PIN_RC_TT01_02 = smd 1.02 x 3.17: 1:SIGNAL3 -2.54,0; 2:VCC3 0,0; 3:GND3 2.54,0
SC-59 = smd 1 x 1.4: B -0.95,-1.2; C 0,1.2; E 0.95,-1.2
US6 = smd 0.3 x 0.635: 1 -0.65,-1.05; 2 0,-1.05; 3 0.65,-1.05; 4 0.65,1.05; 5 0,1.05; 6 -0.65,1.05
KC2016Z = smd 0.6 x 0.8: #1 -0.9,-0.6; #2 0.9,-0.6; #3 0.9,0.6; #4 -0.9,0.6
CSTNE_V_C = smd 0.4 x 1.9: 1 1.2,0; 2 0,0; 3 -1.2,0

### Placement (x,y rotation side)
ANA2  27.3,17.2 0 top
ANA6  31.4,10.5 0 top
BEC1  2.4,23.85 0 top
BEC50  17.95,26.45 0 top
BEC62TP  20.35,44.35 0 top
BEC62TP1  27.9,44.25 0 top
C1  29.74,11.02 270 top
C2  10.35,20.27 180 bottom
C3  18.52,12.17 270 top
C4  5.28,38.12 270 top
C5  9.95,19.65 90 top
C6  17.3,11.9 90 top
C7  11.8,30.3 270 top
C8  22.6,26.5 90 bottom
C9  18.25,24.8 270 bottom
C14  33.23,57.82 0 bottom
C15  32.82,61.92 0 bottom
C17  10.93,38.62 270 top
C18  16.68,38.42 0 bottom
C20  22.82,40.92 270 top
C21  34.88,60.47 90 bottom
C22  7.47,34.07 90 top
C23  15.32,32.02 0 bottom
C24  16.92,34.67 270 bottom
D2  34.88,63.52 270 bottom
DONKEY  YELLOW  [0603']  63.2,9.5 0 top
I2C  73.8,9.4 180 bottom
IC1  24.29,10.59 0 top
IC2  31.86,11.77 0 top
IC3  19.38,37.27 180 top
IC4  10.79,26.51 270 top
IC5  32.38,59.82 270 bottom
ICSP1  47.2,8.63 180 top
JETSON  GREEN  [0603']  54.59,6.24 0 top
JP1  65.35,20.9 180 bottom
JP2  69.75,20.85 180 bottom
LED0TP  4.3,25.2 0 bottom
LED1TP  2.15,37.45 0 bottom
Q1  22.32,30.32 90 top
Q2  17.68,30.32 90 top
Q3  8.7,30.2 180 top
Q4  5.6,52.75 0 bottom
Q5  10.6,47.4 0 bottom
R1  16.18,24.42 0 bottom
R2  22.62,19.97 180 top
R3  17.23,26.62 0 bottom
R4  8.35,31.9 0 bottom
R5  64.82,6.22 180 top
R6  10.35,28 90 top
R7  6.35,33.55 90 bottom
R8  10.45,34.5 90 top
R9  14.6,41.3 90 top
R10  58.37,6.12 180 top
R11  19.48,27.02 270 top
R12  22.07,18.23 0 top
R13  22.07,16.73 0 top
R14  14.82,29.27 270 top
R15  5.38,43.07 90 top
R16  12.28,42.87 0 top
R17  6.75,37.4 90 bottom
R18  23.38,26.92 270 top
R19  21.38,27.37 270 top
R20  25.38,50.87 180 bottom
R21  35.38,50.62 180 bottom
R22  37.92,9.47 45 bottom
R23  35.53,9.75 45 bottom
R24  9.05,32.45 180 top
R25  18.7,20 225 top
R26  6.5,29.7 90 top
R27  2,46.6 180 bottom
R28  12.9,30.3 90 top
R29  7.8,46.95 180 bottom
R30  13.07,18.57 270 top
R31  14.6,21.25 0 top
R32  10.7,44.85 0 bottom
R33  5.8,50.35 0 bottom
R34  15.85,51.4 0 bottom
R35  8.55,50.85 0 bottom
R36  39,10.2 180 top
R37  53.45,10.25 0 bottom
R38  56.7,10.25 0 bottom
R39  59.2,9.75 315 bottom
R40  65.9,9.55 180 top
R41  6.35,35 0 bottom
R42  6.65,39.6 90 bottom
R43  5.65,37.35 90 bottom
R44  60.3,19.35 315 bottom
R45  55.2,18.9 45 bottom
RC  RED  [0603']  61.68,6.17 0 top
RCPWR  ORANGE  [0603']  13.75,38.65 90 top
SPI-LED  23.7,16.3 180 bottom
SW1  73.9,5.75 180 top
T5  4.42,34.12 270 top
T6  19.57,34.87 180 bottom
TP1  20.27,19.38 90 top
TP2  19.83,17.32 0 top
TP3  63.21,20.02 0 top
U1  7.65,24.35 180 top
U7  12.38,25.12 90 top
U8  8.18,40.67 180 top
U9  2.48,40.67 180 top
U10  11.18,34.72 90 bottom
U11  11.12,39.42 90 bottom
U$1  22.9,47.1 0 top
U$2  [LOGO_FABO_L]  41.6,18 0 top
U$3  42.1,47.1 0 bottom
U$5  [LOGO_SILK_GND]  16.7,60.4 90 top
U$6  [LOGO_SILK_GND]  24.3,60.4 90 top
U$7  [LOGO_SILK_GND]  34.6,60.4 90 top
U$8  [LOGO_SILK_GND]  44.5,60.4 90 top
U$9  16.15,18.7 45 top
U$10  5.2,27.75 0 bottom
U$11  20.65,26.2 0 bottom
U$12  [LOGO_SILK_GND]  9,60.4 90 top
X2  18.01,8.29 90 top

### Tracks (layer width: path | path; a pad name or v marks a point on that pad's centre or on a via)
0  (via drill 0.35)
  Top 0.152: v17.5,31.3 16.8,32 16.2,32 15.6,32.6 v15.6,36.9 15.6,37.7 16,38.1 v18.7,38.1 19.5,38.9 v19.5,39.3 | v12.9,35 12.97,34.92 12.97,33.48 v12.4,32.9 12.3,32.8 11.3,32.8 10.7,32.2 10.7,31.68 10.7,31.05 10.15,30.5 8.35,30.5 7.75,31.1 Q3.S | v16.5,45.5 15.28,46.72 U$1.6:GND2 14.2,48.18 v14.2,49.6 | U$1.9:GND1 22.82,47.02 22.82,46.7 | 22.82,46.7 C20.1 21.9,42.65 v21.9,43 | U$1.13:ST_GND 33.06,45.76 | IC3.15 v21,38.1 | v12.1,54.4 12.4,54.7 17.7,54.7 v18.4,54 23.8,59.4 23.9,59.4 | v31.4,57 29.4,59 v29.4,61 27.8,59.4 23.9,59.4 | v24.4,38 23.4,37 v23.4,36 24.7,36 v25.6,35.1 | IC3.8 16.1,41.55 16.1,41.6 | 16.1,41.6 v16.1,41.7 16.1,43.4 15.4,44.1 11.1,44.1 10.15,45.05 v8.8,45.05 8.65,44.9 8.1,44.9 7.66,45.34 U$1.3:GND3 | v0.7,54 1,53.7 1,50.8 1.5,50.3 v3.7,50.3 | v25.6,35.1 25.6,31.8 v25.8,31.6 25.8,29.1 v25,28.3 | v25.6,35.1 25.6,39.9 v25.5,40 v25.5,42.3 25.5,42.4 v26.6,43.5 | 33.06,45.76 31.5,44.2 v30,44.2 29.95,44.25 BEC62TP1.1 27.35,44.25 v26.6,43.5 | 33.06,45.76 33.06,44.34 v33.1,44.3 36.7,44.3 v36.9,44.1 40.3,44.1 v40.4,44.2 42.3,44.2 43.22,45.12 U$1.17:TH_GND 43.22,48.57 45.25,50.6 45.25,54.4 v43.9,55.75 | 11.8,30.9 C7.1 R28.2 13.45,31.4 v13.45,32 | R9.2 15.85,41.85 16.1,41.6 | v36.45,57.75 36.4,57.8 36.4,65.05 v35.35,66.1 | v26.6,43.5 26.02,43.5 22.82,46.7 | v33.4,68 33.55,68.15 v38.2,68.15 42.95,68.15 v43.3,67.8 43.9,67.2 v43.9,62.75 41.5,65.15 v39.8,65.15 39.8,62.65 v39.1,61.95 | v29.4,68 25.9,64.5 v25.9,63.7 25.9,61.4 23.9,59.4
  Top 0.406: Q3.S 7.75,31.95 R24.2
  Bottom 0.152: v16.1,41.7 17.1,41.7 v19.5,39.3 19.7,39.3 | U11.4 15.29,41.7 16,41.7 | 16,41.7 v16.1,41.7 | v12.9,35 13.89,35.99 U10.4 15.23,36.9 v15.6,36.9 15.8,37.1 17.2,37.1 17.7,37.6 17.7,38.42 C18.1 18.38,38.42 v18.7,38.1 19.57,37.23 T6.2 19.57,35.48 19.1,35 17.32,35 16.92,35.4 | v16.5,45.5 16.5,42.2 16,41.7 | 19.7,39.3 19.8,39.3 v21,38.1 23.1,36 v23.4,36 | 19.7,39.3 21.9,41.5 v21.9,43 21.9,44.1 22.55,44.75 v23.65,44.75 | v17.5,31.3 16.84,31.3 C23.1 15.7,32.45 15.7,34.1 16.92,35.32 16.92,35.4 | C24.1 16.92,35.4 | v2,62.7 1.3,62 1.3,59.3 v1.4,59.2 0.6,58.4 0.6,54.1 v0.7,54 1.3,54.6 v4.4,54.6 8.3,54.6 v8.6,54.3 12,54.3 | v29.4,68 v29.4,65 v29.4,61 30.7,62.3 v30.7,62.6 30.7,63.3 v32.4,65 32.4,67 v33.4,68 33.45,68 v35.35,66.1 35.1,65.85 34.55,65.85 33.62,64.92 C15.1 33.65,61.9 | v43.9,62.75 v43.9,58.75 v43.9,55.75 | v36.4,54 v39.4,57 38.65,57.75 v36.45,57.75 35.45,57.75 35,58.2 35,59.55 C21.1 34.83,59.62 | v36.4,54 34.02,56.38 C14.1 34.15,57.95 | v36.4,54 v32.4,54 31.4,55 v31.4,57 | v15.9,40.4 15.9,41.5 v16.1,41.7 | v10.85,49.8 10.85,53.15 12,54.3 | 12,54.3 v12.1,54.4 | 9.82,44.92 R32.2 9.3,44.25 5.05,44.25 3.7,45.6 v3.7,50.3 3.75,50.35 R33.2 4.65,50.7 Q4.S | 9.82,44.92 9.65,45.1 Q5.S | v8.8,45.05 8.93,44.92 9.82,44.92 | v12.4,32.9 13.3,32 v13.45,32 | IC5.2 33.88,59.62 | U$3.3:GND3 39.56,45.04 v40.4,44.2
  Bottom 0.305: IC5.2 34.62,59.82 34.83,59.62
  pour Top (rank 5): 5.45,30.9 5.45,27.3 6.55,26.2 16.9,26.2 19.1,24 22.4,24 29,30.6 29,35.8 33.8,40.6 45,40.6 48.1,43.7 48.1,77.3 34.7,90.7 -1.3,90.7 -3.6,88.4 -3.6,43.8 -1.6,41.8 7.4,41.8 7.6,42 9.7,42 11.9,39.8 11.9,36.9 11.4,36.4 10.4,36.4 8,34 8,32.7 7.8,32.5 7.05,32.5
  pour Bottom (rank 5): 19.1,28.3 22.7,28.3 24,27 25,27 28.3,30.3 28.3,35.7 33.5,40.9 44.5,40.9 47.4,43.8 47.4,75.3 34,88.7 0.2,88.7 -1.4,87.1 -1.4,42.7 -0.9,42.2 9.3,42.2 12,39.5 12,36.9 11.3,36.2 11.3,32.65 12.65,31.3 14,31.3 14.5,30.8 14.5,26.1 14.7,25.9 16.7,25.9
3V3  (via drill 0.35)
  Top 0.152: v46.4,6.6 45.93,7.07 ICSP1.2 | IC2.1 31.4,14.77 31.4,19.3 v29.1,21.6 28.4,21.6 25.45,24.55 v25.45,25.25 | U9.6 3.44,37.82 3.44,39.74 4.7,41 8.3,41 9.45,39.85 U8.6 | U9.6 3.75,36.74 v3.2,36.2 | v11.8,18.6 11.8,19.7 11.3,20.2 C5.2 9.3,20.2 8.92,20.58 U1.6 | C4.2 5.19,37.48 3.78,37.48 U9.6 | T5.5 6.97,34.12 C22.2 7.77,34.62 8.8,35.65 8.8,36.1 9.45,36.74 U8.6 | IC1.18 27.82,8.59 27.5,8.9 27.5,9.5 26.7,10.3 26.7,10.8 27.4,11.5 27.4,12.6 27.2,12.8 26.5,12.8 25.2,11.5 25.2,10.7 23.68,9.19 v21.64,9.19 21.44,9.38 IC1.6 19.72,9.38 19.1,10.01 19.1,10.8 | 19.1,10.8 19.1,11.04 C3.2 18,11.1 C6.1 | 19.1,10.8 19.29,10.98 IC1.4 | R2.2 21.09,20.7 19.4,20.7 R25.1 17.91,20.39 17.45,20.85 16.65,20.85 v16.3,21.2 | U8.6 10.62,37.52 C17.2
  Top 0.305: IC1.18 31.79,8.59 32.73,9.53 32.73,12.63 IC2.1
  Bottom 0.152: 37.35,10.05 36.9,10.5 36.4,10.5 36.22,10.32 R23.2 | 37.35,10.05 R22.2 | 37,13.8 36.5,14.3 34.4,14.3 IC2.1 | 37,13.8 37.5,14.3 49.2,14.3 | 49.2,14.3 49.6,13.9 49.6,8.7 47.5,6.6 v46.4,6.6 | v29.1,21.6 28.1,20.6 16.85,20.6 16.25,21.2 v16.3,21.2 15.29,22.21 IC4.28 12.11,22.21 11.14,21.25 C2.2 11.8,19.61 v11.8,18.6 11.7,18.5 5.3,18.5 2.9,20.9 2.9,35.9 v3.2,36.2 | 37.35,10.05 37.5,10.2 37.5,11.3 37,11.8 37,13.8 | U$11.#4 U$11.#1 22.25,25.6 C8.1 | C8.1 22.95,25.95 | C8.1 24.75,25.95 v25.45,25.25 | IC2.17 53.45,13.35 54.7,14.6 54.7,16.7 54.2,17.2 50.8,17.2 50.2,17.8 | 50.2,17.8 50.2,18.5 51.2,19.5 54.6,19.5 R45.2 56.83,19.47 57.4,18.9 59.62,18.9 R44.2 | 49.2,14.3 49.7,14.8 49.7,17.3 50.2,17.8
5V  (via drill 0.35)
  Top 0.152: IC2.2 32.25,16.45 32.25,19.45 29.25,22.45 28.65,22.45 26.5,24.6 26.5,25.4 25.4,26.5 25.1,26.5 24.4,25.8 24.4,25.3 22.95,23.85 19.05,23.85 18,24.9 17.1,24.9 16.3,25.7 12.7,25.7 v12.45,25.95
  Top 0.254: v71.7,11.3 72,11.6 v72.7,11.6 73.2,11.1 82.6,11.1 83.25,11.75 83.25,16.7 82.65,17.3 v46.9,17.3 46.2,18 v46.1,18 45.6,18 v45.2,17.6
  Bottom 0.152: v12.45,25.95 12.3,26.1 12.3,30.85 10.47,32.67 | R4.1 9.68,32.67 10.47,32.67 | R17.1 7.6,36.85 7.85,37.1 9.1,37.1 9.8,36.4 9.8,33.35 10.47,32.67 | I2C.5V 72.8,11.5
  Bottom 0.254: IC2.2 34.76,17.2 46.8,17.2 v46.9,17.3
  Bottom 0.305: IC2.2 30.16,18.55 23.55,18.55 22.7,17.7 SPI-LED.5V | 72.8,11.5 v72.7,11.6
  pour Bottom (no thermals): 72.45,10.1 71.6,10.95 71.65,10.95 71.4,11.2 71.4,11.6 71.7,11.9 72.9,11.9 73.7,11.1 73.7,10.5 73.3,10.1
  pour Top (no thermals): 71.72,10.68 71.25,11.15 71.25,11.35 71.8,11.9 73.1,11.9 73.98,11.02
  pour Bottom (no thermals): 44.9,17 44.4,17.5 44.4,18 44.9,18.5 45.7,18.5 46.2,18.5 47.3,17.4 47.3,17.1 47.2,17
  pour Top: 44.3,17.4 44.3,17.9 44.9,18.5 47.2,18.5 47.3,18.4 48.1,18.4 48.7,17.8 48.7,17.5 48.1,16.9 44.8,16.9
AD2
  Top 0.152: IC1.25 27.09,16.99 ANA2.1
AD6
  Top 0.152: IC1.19 30.89,9.38 31.4,9.9 ANA6.1
AVR_MISO  (via drill 0.35)
  Top 0.152: IC1.16 27.98,5.6 48.5,5.6 49.9,7 49.9,9 | 49.9,9 49.9,9.6 48.7,10.8 46.8,10.8 45.9,9.9 45.9,9.3 ICSP1.1 | 54.75,8.9 v54.8,8.95 54,8.95 53.45,9.5 51.85,9.5 51.6,9.25 50.15,9.25 49.9,9
  Bottom 0.152: R38.2 55.9,9.6 55.25,8.95 v54.8,8.95
AVR_MOSI  (via drill 0.35)
  Top 0.152: ICSP1.4 44.66,7.46 | 44.66,7.46 43.5,6.3 28.6,6.3 27.5,7.4 27.3,7.4 | 27.3,7.4 26.6,7.4 26.29,7.09 IC1.15 | v26.8,12 25.8,11 25.8,8.9 27.3,7.4 | v45.7,10.7 46.3,11.3 49.8,11.3 50.95,10.15 v51.3,10.15 | v45.1,6.8 44.66,7.24 44.66,7.46
  Bottom 0.152: v26.8,12 26.7,12.1 SPI-LED.DI | v45.7,10.7 45.1,10.1 v45.1,6.8 | R37.2 52.55,10.15 v51.3,10.15
AVR_RESET  (via drill 0.35)
  Top 0.152: ICSP1.5 43.39,10.61 42.9,11.1 41.3,11.1 40.7,10.5 40.7,9.8 40.2,9.3 39.1,9.3 R36.2 37.5,10.2 36.8,9.5 34.6,9.5 33.5,8.4 v32.8,8.4 | v24.4,10.7 24.4,10.8 23.1,12.1 23.1,13.3 23.89,14.09 IC1.29 23.89,15.09 24.9,16.1 24.9,19.3 24.23,19.97 R2.1
  Bottom 0.152: v32.8,8.4 25.8,8.4 24.9,9.3 24.9,10.2 v24.4,10.7
AVR_RX
  Top 0.152: IC1.30 23.09,15.39 23.4,15.7 23.7,15.7 24,16 24,17.9 23.68,18.23 R12.2
AVR_SCK  (via drill 0.35)
  Top 0.152: ICSP1.3 44.66,9.94 v44.2,10.4 | v26.64,9.24 26.64,9.04 27.2,8.49 27.2,8.3 27.71,7.79 IC1.17 30.11,7.79 30.5,7.4 36.7,7.4 37.1,7 39.8,7 v39.98,7.18 | v48.4,10.1 48.8,9.7 48.8,7.5 v49.1,7.2
  Bottom 0.152: v39.98,7.18 40.09,7.18 40.6,7.7 40.6,10.5 41.2,11.1 43.3,11.1 44,10.4 v44.2,10.4 44.2,11 44.8,11.6 47.3,11.6 48.4,10.5 v48.4,10.1 | v26.64,9.24 25.5,10.39 25.5,11.37 25.5,11.71 24.7,12.5 SPI-LED.CI | v49.1,7.2 49.9,8 55.95,8 56.65,8.7 58.15,8.7 R39.2
AVR_TX
  Top 0.152: IC1.31 22.29,16.14 R13.2
B0_BEC
  Top 0.152: IC3.3 20.35,38.55 19,37.2 18,37.2 16.23,35.42 16.23,33.12 16.65,32.7 19.7,32.7 21.18,31.23 Q1.D 21.08,30.22 21.08,29.62 21.38,29.32 R19.1
B0_INPUT  (via drill 0.35)
  Top 0.152: Q1.S 23.48,33.52 v23.4,33.6
  Bottom 0.152: v23.4,33.6 22.5,34.5 18.9,34.5 18.5,34.1 18.5,33.7 T6.6
B0_NOT
  Bottom 0.152: T6.1 18.3,36.5 16.3,36.5 15.6,35.8 15.6,35.2 15.12,34.72 U10.5
B1_BEC
  Top 0.152: IC3.6 18.4,39.3 18.1,39 15.15,39 14.65,38.5 14.65,32.2 Q2.D 15.07,30.32 R14.1
B1_INPUT  (via drill 0.35)
  Top 0.152: Q2.S 19.63,31.27 v20,30.9
  Bottom 0.152: v20,30.9 20.52,31.43 T6.4
B1_NOT
  Bottom 0.152: U11.5 14.38,39.52 18.28,39.52 20.52,37.27 T6.3
BEC_50  (via drill 0.35)
  Top 0.152: v22.4,24.8 23.38,25.77 R18.2 | v16.1,29.2 16.4,29.5 17.2,29.5 17.5,29.8 17.5,30.1 17.7,30.3 19.2,30.3 20.4,29.1 20.4,26.8 19.82,26.22 R11.2 19.48,26.15 | 19.48,26.15 19.48,25.02 19.85,24.65 v20.55,24.65 | BEC50.1 19.18,26.45 19.48,26.15
  Bottom 0.152: v22.4,24.8 22.25,24.65 v20.55,24.65 | T6.5 19.57,32.77 19.1,32.3 | 19.1,32.3 17.6,32.3 16.92,32.98 C24.2 | C18.2 14.54,38.42 U11.6 14.3,38.12 13.78,38.12 | 13.78,38.12 12.4,39.5 12.4,51.25 16.25,55.1 25.41,55.1 IC5.5 31.11,60.8 31.7,60.8 32.1,61.2 32.1,61.55 32.02,61.62 C15.2 | U10.6 14.2,33.45 | 14.2,33.45 12.95,33.45 11.9,34.5 11.9,36.4 13.62,38.12 13.78,38.12 | 19.1,32.3 18.7,31.9 18.7,30.6 18,29.9 16.8,29.9 v16.1,29.2 16.1,29.3 14.53,30.88 C23.2 14.2,32.34 14.2,33.45
BEC_60  (via drill 0.35)
  Top 0.152: 23.9,39.3 23.9,39.2 21.65,36.95 IC3.16 21.65,32.35 v21.7,32.3 22.4,31.6 22.4,27.6 R19.2 | 23.9,39.3 v23.9,43.2 | v15.05,26.6 12.35,26.6 11.74,27.21 U7.4 11.74,29.69 C7.2 | C20.2 23.08,40.12 23.9,39.3 | R14.2 15.5,28.47 v16.12,27.86
  Bottom 0.152: v23.9,43.2 28.7,48 35.2,48 | 35.2,48 35.3,48 | v21.7,32.3 21.23,31.83 21.23,30.99 19.54,29.3 17.56,29.3 v16.12,27.86 15.05,26.79 v15.05,26.6 | 35.2,48 36.7,49.5 38.3,49.5 38.9,50.1 38.9,54.5 40.4,56 40.4,59.2 37.3,62.3 34.88,62.3 | 33.88,60.97 IC5.1 32.87,60.77 32.6,60.5 32.6,59.2 32.93,58.87 IC5.3 | C21.2 34.88,62.3 | 34.88,62.3 D2.C
  Bottom 0.305: IC5.1 34.38,60.77 C21.2
BEC_62  (via drill 0.35)
  Top 0.152: U$1.5:VCC2 12.74,47 12.74,46.66 v13.9,45.5 | RCPWR.ANODE 13.6,37.7 | R16.2 13.1,42.84 v13.1,41.5 12.8,41.2 12.8,38.75 13.7,37.85 RCPWR.ANODE | R15.2 5.12,44.12 U$1.2:VCC3 | RCPWR.ANODE 14,37.6 14,34.7 13.75,34.45 13.75,33.3 12.6,32.15 11.85,32.15 11.15,31.45 11.15,30.35 10.35,29.55 R6.2 | 25.5,53 26.5,52 | U$1.8:VCC1
  Top 0.406: U$1.2:VCC3 5.12,50.82 6.2,51.9 11.7,51.9 12.74,50.86 | 12.74,47 12.74,50.86 | 12.74,50.86 13.68,51.8 19.5,51.8 20.36,50.94 | U$1.8:VCC1 20.36,50.94 | 20.36,50.94 21.42,52 26.5,52 29.5,52 30.35,51.15 | U$1.12:ST_VCC 30.52,50.98 30.35,51.15 | 30.35,51.15 31.4,52.2 40.8,52.2 v41.4,51.6 41.4,50.8 v41.85,50.35 40.68,49.18 U$1.16:TH_VCC | BEC62TP.1 U$1.8:VCC1
  Bottom 0.152: v13.9,45.5 13.9,42.3 v13.1,41.5 | D2.A 38.38,64.67 41.8,61.25 41.8,52.9 v42.65,52.05 | v42.65,52.05 43.1,51.6 v43.1,50.8 | v42.65,52.05 42.2,51.6 v41.4,51.6 | U$3.2:VCC3 41.85,47.35 v41.85,50.35
  pour Top (no thermals): 4.2,45.7 4.2,49.5 4.7,50 4.7,50.7 6.8,52.8 43,52.8 44,51.8 44,50.75 41.5,48.25 41.5,45.7 41.4,45.6 40,45.6 39.7,45.9 39.7,50 38.5,51.2 32.4,51.2 31.2,50 31.2,45.6 30.9,45.3 30.2,45.3 29.5,46 29.5,50.5 28.5,51.5 22.7,51.5 21.5,50.3 21.5,45.8 21.2,45.5 19.8,45.5 19.5,45.8 19.5,49.6 18.6,50.5 13.8,50.5 13.2,49.9 13.2,46.4 13.3,46.3 12.7,45.7 12.4,45.7 12.2,45.9 12.2,50.2 11.3,51.1 7,51.1 5.8,49.9 5.8,45.9 5.4,45.5 4.4,45.5
  pour Bottom (no thermals): 34.35,64.15 34.35,64.95 34.5,65.1 38.75,65.1 42.85,61 42.85,54.15 44.1,52.9 44.1,50.6 43.05,49.55 43.05,45.65 42.6,45.2 41.55,45.2 41.15,45.6 41.15,48.85 40.55,49.45 40.55,55 41.1,55.55 41.1,61.1 38.25,63.95 34.55,63.95
D3  (via drill 0.35)
  Top 0.152: RC.ANODE 59.62,4.9 52.6,4.9 v52.4,5.1 | v23,10 22.7,10.3 22.7,10.8 22.6,10.9 22.6,12.5 21.71,13.38 IC1.1
  Bottom 0.152: v52.4,5.1 51.75,4.45 24.55,4.45 23.1,5.9 23.1,9.9 v23,10
D4  (via drill 0.35)
  Top 0.152: JETSON.ANODE 50.44,6.24 48.1,3.9 23.7,3.9 v22.7,4.9 | v21.6,12 21.02,12.59 IC1.2
  Bottom 0.152: v22.7,4.9 22.4,5.2 22.4,9.5 21.6,10.3 v21.6,12
GND  (via drill 0.35)
  Top 0.152: IC1.21 29.06,10.98 29.74,11.66 C1.1 30.02,12.1 v31.2,12.1 | ICSP1.6 43.56,7.83 v43.56,7.14 | 16.3,8.29 X2.2 | IC1.5 21.09,10.19 21.3,10.4 21.3,11.23 20.8,11.74 20.24,11.74 IC1.3 19.46,11.79 18.55,12.7 | v29,17.4 29,17.7 26.9,19.8 v26.85,19.8 26.85,19.95 v25.4,21.4 | U8.4 6.57,37.85 | 55.99,15.5 55.99,14.79 55.5,14.3 v52.2,14.3 49.65,14.3 IC2.14 47.09,14.3 44.55,14.3 IC2.9 | 55.99,15.5 IC2.20 | IC2.25 62.34,14.3 57.19,14.3 55.99,15.5 | IC2.25 64.88,14.3 67.7,14.3 68.69,15.29 | 68.69,15.29 IC2.30 | 68.69,15.29 69.58,14.4 72.59,14.4 IC2.34 75.05,14.3 80.12,14.3 IC2.39 | v6.3,31.85 5.95,31.5 | v10.4,25.5 10.1,25.2 5.7,25.2 4.56,26.34 v4.56,29.65 4.56,30.11 v6.3,31.85 | 29.85,23 v32.9,19.95 | C3.1 18.55,12.7 | v10,40.3 10.04,40.3 C17.1 | v56.4,7.2 57,7.8 v57.95,7.8 58.6,8.45 59.85,8.45 v60.4,9 | v60.4,9 63.61,12.21 | 63.61,12.21 IC2.25 | 75.5,23 v78.4,23 v81.4,23 81.4,22 v82.4,21 82.2,21 v80.8,19.6 | 75.5,23 v75.4,23 v72.4,23 v66.4,23 66.21,22.81 63.21,22.81 | v56.4,23 v60.4,23 63.02,23 63.21,22.81 | v56.4,23 v52.4,23 | v52.4,23 v48.4,23 v44.4,23 v40.4,23 | v40.4,23 v37.4,23 29.85,23 | v40.4,23 40.4,20.4 v39.5,19.5 | v16,7.7 16.3,8 16.3,8.29 | 16.3,8.29 16.3,8.8 v16,9.1 v16,11.9 | TP3.1 63.21,22.81 | v1.2,31.8 2,31 v2,30.7 | 66,4.1 v65.9,4.1 65.15,4.85 63.6,4.85 v63.4,5.05 | v78.3,9.7 80.8,9.7 v81.1,9.4 | v34.8,8.24 37.36,8.24 37.63,7.97 v37.6,7.94 38.26,8.6 v39.7,8.6 | v33.7,9.84 35.1,11.24 v36.2,11.24 36.46,11.24 36.8,10.9 37.6,10.9 37.8,11.1 39.5,11.1 v39.9,11.5 | v52.7,18.9 52.7,22.7 v52.4,23 | v75.2,18.2 75.2,18.25 | 75.2,18.25 75.2,22.7 75.5,23 | 18.55,12.7 C6.2 16.4,12.7 v16,13.1 15.85,13.1 v13.85,15.1 11.6,17.35 v11.5,17.35 11.5,17.55 C5.1
  Top 0.152: 66,4.1 66,5.84 R5.1 65.25,6.59 v65.25,8.15 66.65,9.55 R40.1 67.95,10.8 v68,10.8 | R10.1 59.17,7.07 60.4,8.3 60.4,8.9 | 60.4,8.9 v60.4,9 | 60.6,9.1 60.4,8.9 | C5.1 9.15,19.1 v8.85,19.4 | v10.4,22.15 11.1,22.85 12.49,22.85 13.01,22.33 U7.2 13.1,21.79 v13.1,20.6 | U$9.E 18.25,17.94 v18.25,17.1 | v6.3,31.85 6.95,32.5 6.95,33 C22.1 | U8.4 6.91,38.55 6.6,38.85 5.46,38.85 C4.1 4.84,39.1 v4.3,39.1 | v51,7.2 52.5,8.7 v52.6,8.7 | v52.05,11.6 55.1,11.6 v55.4,11.3 58.6,11.3 v58.7,11.2 v61.25,11.2 | U8.4 6.91,36.55 6.4,36.05 v4.9,36.05 4.2,35.35 4.2,34.7 3.7,34.2 3.21,34.2 T5.2 3.1,34.15 2.05,34.15 1.7,34.5 v1.7,35.5 1.21,35.99 U9.4 1.21,38.35 1.85,39 2.3,39 v2.4,39.1 2.75,39.45 2.75,39.95 3.05,40.25 v3.05,41.05 2.7,41.4 1.45,41.4 v1.05,41 | 75.5,23 75.5,22.75 v76.85,21.4 76.85,21.25 v78.35,19.75 | v63.9,10.8 63.61,11.09 63.61,12.21 | 66,4.1 67.35,2.75 SW1.3 71.4,5.35 | 71.4,5.35 SW1.6 71.4,6.75 v70.3,5.65 | U1.4 6.15,21.2 v5.15,22.2 | v3.85,23 3.85,21.4 v4.2,21.05 v5.35,19.9 | 71.4,5.35 71.8,5.75 v72.6,5.75 | 29.85,23 28.9,23.95 v28.9,24.4 | v2.7,19.55 3.9,18.35 9.2,18.35 C5.1 | v18.75,4.85 v17.7,5.9 | TP3.1 62.09,18.9 v61.75,18.9 | 64.28,18.95 TP3.1 | 75.2,18.25 74.1,19.35 v73.15,19.35 72.7,18.9 71.7,18.9 71.4,18.6 v71.4,18.25 | v50.15,21.9 50.15,21.4 v48.6,19.85 | v60.2,21.15 59.75,21.15 v58.5,19.9 56.4,22 v56.4,23
  Bottom 0.152: v43.56,7.14 44.8,5.9 | 48.8,5.9 48.7,5.9 | 48.7,5.9 44.8,5.9 | IC2.14 48.37,17.03 45.6,19.8 39.6,19.8 39.6,19.5 | 39.6,19.5 v39.5,19.5 33.35,19.5 v32.9,19.95 27,19.95 v26.85,19.8 22.5,19.8 20.7,18 SPI-LED.GND 20.35,16.4 19.65,17.1 v18.25,17.1 16.6,17.1 16.2,16.7 16.2,15.45 v15.6,14.85 14.1,14.85 v13.85,15.1 14.8,16.05 14.8,17.2 v14.55,17.45 13.1,18.9 v13.1,20.6 | v29,17.4 29.5,17.4 31.2,15.7 v31.2,13.4 v31.2,12.1 | v10,40.3 9.61,40.69 | 12.6,24.81 9.3,24.81 | 9.3,24.81 IC4.5 | IC4.4 7.91,24.2 8.8,24.2 | 8.8,24.2 9.3,24.7 9.3,24.81 | 8.8,24.2 8.8,23.6 8.71,23.51 IC4.3 7.1,23.51 | IC4.2 6.94,22.86 6.8,23 | 6.8,23 6.8,23.3 7.01,23.51 7.1,23.51 | 6.8,22.95 6.8,22.4 7,22.2 7.01,22.21 IC4.1 8.89,22.21 9.5,21.6 9.5,20.45 | 6.8,22.95 6.8,23 | IC4.14 7.49,30.66 | 7.49,30.66 7.41,30.66 7,30.25 7,27.25 6.45,26.7 U$10.1 | 7.49,30.66 v6.3,31.85 | v10.4,25.5 11.91,25.5 12.6,24.81 | v33,17.9 33.1,18 v35.8,18 36.3,18.5 39,18.5 39.6,19.1 39.6,19.5 | v1.7,35.5 2.3,34.9 2.3,31 v2,30.7 1.75,30.45 1.75,28.6 v1.8,28.55 1.75,28.5 v1.75,25.75 v1.75,22.15 1.75,20.5 v2.7,19.55 | v2.4,39.1 v4.3,39.1 | v18.05,21.85 24.95,21.85 v25.4,21.4 | v25.1,7.9 25.4,7.9 25.8,7.5 36.9,7.5 37.34,7.94 v37.6,7.94 | IC2.30 70,14.27 70,10.2 | IC4.24 12.6,24.81 | 44.8,5.9 39.5,5.9 39.1,6.3 39.1,7.7 39.7,8.3 v39.7,8.6 39.7,11.3 v39.9,11.5 40.01,11.61 41.9,11.61 43.29,12.99 IC2.9 | v56.4,7.2 v51,7.2 50.6,7.2 49.7,6.3 49.1,6.3 48.7,5.9 | 7.1,23.51 6.76,23.85 4.7,23.85 v3.85,23 4.65,22.2 v5.15,22.2 5.95,23 v6.05,23 6.75,23 6.8,22.95 | 9.5,20.45 9.5,20.27 C2.1 8.85,19.57 v8.85,19.4 8.35,19.9 v5.35,19.9 | v19.9,6.2 18,6.2 v17.7,5.9 16,7.6 v16,7.7
  Bottom 0.152: v16,11.9 v16,13.1 | IC2.39 81.39,9.69 v81.1,9.4 | 63.61,12.61 IC2.25 | v83,18.3 83,20.4 v82.4,21 | R1.1 17.07,24.32 18.18,24.32 C9.2 18.95,24.25 | 18.95,24.25 19.3,23.9 24.2,23.9 v24.55,24.25 24.55,24.1 26.15,24.1 27.2,25.15 v27.45,25.15 | R3.1 19.3,27.9 | 19.3,27.9 | U$11.#2 19.75,25.05 18.95,24.25 | 19.3,27.9 22.3,27.9 22.6,27.6 C8.2 22.75,27.05 23.15,26.65 24.55,26.65 24.65,26.55 v26.45,26.55 26.45,26.15 v27.45,25.15 | 70,10.2 69.4,10.8 v68,10.8 | v10.4,22.15 10.25,22 10.25,21 9.7,20.45 9.5,20.45 | v4.56,29.65 v4.55,29.64 U$10.4 | v10,40.3 8.75,41.55 7,41.55 6.75,41.3 3.3,41.3 v3.05,41.05 | v52.6,8.7 51.1,8.7 50.35,9.45 50.35,10.55 51.4,11.6 v52.05,11.6 52.2,11.75 v52.2,14.3 | v8.65,39.35 9.6,40.3 v10,40.3 | v50.15,21.9 v54.55,21.9 57.8,21.9 58.9,23 v60.4,23 | v72.6,5.75 73.05,6.2 v76.85,6.2 | v27.45,25.15 28.15,25.15 v28.9,24.4 | I2C.GND 70,10.2
  pour Top (rank 6): -8.92,94.33 97.22,94.33 97.22,-1.57 -8.92,-1.57
  pour Bottom (rank 6): -7.58,92.28 99.07,92.28 99.07,-0.07 -7.58,-0.07
GPIO4
  Top 0.152: R36.1 40.75,11.15 IC2.7
LED0
  Bottom 0.152: U$10.5 5.2,30 4.5,30.7 3.8,30.7 3.65,30.55 3.65,25.85 LED0TP.1 4.56,25.46 IC4.6
LED0_5
  Bottom 0.152: R41.1 7.04,35 | R41.1 7.89,35.99 U10.3 | R7.2 6.9,34.65 R41.1
LED0_5V
  Bottom 0.152: U$10.3 4.55,27.35 4.95,27.75 6.25,27.75 6.5,28 6.5,30.45 4.9,32.05 4.9,34.1 R41.2
LED1
  Bottom 0.152: U$10.2 5.25,26.65 5.25,26.15 5.4,26 6.75,26 6.86,26.11 IC4.7
LED1_5
  Bottom 0.152: U11.3 7.97,39.77 7.25,39.05 R42.1 6.5,39.05 5.65,38.2 R43.2
LED1_5V
  Bottom 0.152: U$10.6 5.85,30.15 4.05,31.95 4.05,37.55 | R42.2 6.3,39.8 5.95,39.8 5.65,39.5 5.65,39.15 4.05,37.55 | LED1TP.1 2.25,37.55 4.05,37.55
MISO
  Bottom 0.152: R38.1 57.5,12.01 IC2.21
MODESWITCH  (via drill 0.35)
  Top 0.152: IC1.9 21.49,4.21 v21.7,4 | SW1.5 73.9,6.4 v75.2,5.1 73.9,3.8 SW1.2
  Bottom 0.152: v21.7,4 21.85,3.85 64.7,3.85 66.3,2.25 73.15,2.25 75.2,4.3 v75.2,5.1
MOSI
  Bottom 0.152: R37.1 54.25,11.29 IC2.19
N$2
  Bottom 0.152: U10.1 7.8,33.23 R4.2 6.7,33 R7.1
N$3
  Bottom 0.152: JP1.1 61.85,20.9 R44.1
N$4
  Top 0.152: IC1.20 28.42,10.21 C1.2
N$5
  Top 0.152: IC1.8 19.5,7.09 X2.3
N$6
  Top 0.152: R12.1 21.27,18.38 TP1.1
N$7
  Bottom 0.152: IC4.23 13.76,25.5 15.2,25.5 16.32,26.62 R3.2
N$8  (via drill 0.35)
  Top 0.152: DONKEY.ANODE 60.85,7.95 v60.85,7.3 | v25.85,5.2 25.05,5.2 24.65,5.6 24.65,6.45 IC1.13
  Bottom 0.152: v60.85,7.3 59.55,6 50.7,6 49.9,5.2 v25.85,5.2
N$9
  Top 0.152: R15.1 4.23,42.27 3.75,42.76 U9.1
N$10
  Top 0.152: T5.1 3.12,35.27 2.27,36.12 2.27,37.32 U9.5
N$11  (via drill 0.35)
  Top 0.152: U8.5 8.18,38.73 6.66,40.24 v4.99,40.24 | T5.3 1.63,33.17 v1.3,33.5
  Bottom 0.152: v1.3,33.5 0.7,34.1 0.7,39 v1.8,40.1 1.85,40.15 3.7,40.15 4.3,40.75 4.49,40.75 v4.99,40.24
N$12
  Top 0.152: U8.1 10.39,42.87 R16.1
N$13
  Bottom 0.152: U11.1 6.95,38.15 R17.2 6.75,37.9 R43.1
N$14
  Bottom 0.152: JP2.1 67.9,20.85 67.55,20.5 67.55,17.95 66.95,17.35 56.75,17.35 R45.1
N$15
  Top 0.152: IC1.7 19.71,8.59 18.8,9.5 18.8,9.4 18.1,9.4 X2.1
N$17
  Top 0.152: R13.1 20.43,16.73 TP2.1
N$19
  Top 0.152: RC.CATHODE 63.96,6.17 R5.2
N$20
  Top 0.152: JETSON.CATHODE 57.46,6.24 R10.2
N$21
  Top 0.152: R26.1 6.5,27.62 U1.3
N$22
  Top 0.152: R6.1 9.22,27.2 U1.1
N$23
  Top 0.152: 9.65,32.25 R24.1 9.9,32.5
  Top 0.406: Q3.G 9.65,32.25 9.9,32.5 | R24.1 9.85,33.1 R8.1
N$24
  Top 0.152: R9.1 14.6,40.3 RCPWR.CATHODE
N$25
  Top 0.152: U$9.B 15.31,18.2 14.5,18.2 14.05,18.65 R31.1 14.05,22.55 13.2,23.4 8.45,23.4 7.65,22.6 U1.5 7.65,20.15 6.45,18.95 4.85,18.95 2.95,20.85 2.95,23.3 BEC1.1
N$26
  Top 0.152: R26.2 7.95,29.05 Q3.D
N$27
  Bottom 0.152: Q4.D 4.45,52.75 1.8,52.75 0.7,51.65 0.7,49.1 1.75,48.05 2.45,48.05 2.8,47.7 R27.2
N$28  (via drill 0.35)
  Top 0.152: U9.3 v1.21,45.24 v1.2,45.25
  Bottom 0.152: v1.2,45.25 R27.1
N$29
  Bottom 0.152: Q5.D 9.55,48.55 8.6,47.6 R29.2
N$30  (via drill 0.35)
  Top 0.152: v6.45,45.45 6.45,44.27 U8.3
  Bottom 0.152: R29.1 7,46 v6.45,45.45
N$31
  Bottom 0.152: C14.2 32.12,57.82 IC5.4
N$33  (via drill 0.35)
  Top 0.152: v13.45,53.55 13.54,53.64 v16.2,53.64
  Bottom 0.152: R32.1 11.55,44.9 Q5.G 11.55,49.06 11.86,49.37 11.86,51.96 v13.45,53.55 | R34.2 15.05,52.25 15.3,52.5 16.3,52.5 16.6,52.8 16.6,53.24 v16.2,53.64
N$35  (via drill 0.35)
  Top 0.152: U$1.15:TH_SINGNAL 38.14,49.66 v37.2,50.6
  Bottom 0.152: v37.2,50.6 37.18,50.62 R21.2
N$36  (via drill 0.35)
  Top 0.152: U$1.11:ST_SIGNAL 27.98,50.42 v27.8,50.6
  Bottom 0.152: v27.8,50.6 27.53,50.87 R20.2
N$38
  Bottom 0.152: Q4.G 6.55,50.4 R33.1 7.1,50.85 R35.2
N$39
  Top 0.152: Q2.G 19.5,28.7 19.5,27.84 R11.1
N$40
  Top 0.152: Q1.G 23.48,27.82 R18.1
N$41
  Bottom 0.152: IC4.25 15.12,24.16 R1.2 15.38,24.57 16.3,25.5 18.1,25.5 C9.1 19.7,26.8 U$11.#3
N$43
  Top 0.152: U7.1 11.74,20.76 13.07,19.43 R30.1
N$44
  Top 0.152: 65.05,9.5 R40.2
  Top 0.406: DONKEY.CATHODE 65.05,9.5
PCH1  (via drill 0.35)
  Top 0.152: 17.82,46.58 U$1.7:SIGNAL1 | v16.5,49.6 17.82,48.28 U$1.7:SIGNAL1 | IC3.2 21,42.35 20.25,43.1 19.7,43.1 18.75,44.05 18.75,45.3 18.25,45.8 18.1,45.8 17.82,46.08 U$1.7:SIGNAL1
  Bottom 0.152: R34.1 16.65,49.75 v16.5,49.6
PCH2  (via drill 0.35)
  Top 0.152: IC3.5 19.05,42.7 17.45,44.3 16.5,44.3 16,44.8 11.7,44.8 10.2,46.3 U$1.4:SIGNAL2 8.85,48.45 v8.85,49.15
  Bottom 0.152: R35.1 9.35,49.65 v8.85,49.15
PCH3_328
  Top 0.152: R25.2 17.89,19.61 17.3,20.2 15.95,20.2 U$9.C 15.15,19.7 R31.2 15.15,21.5 15.75,22.1 16.75,22.1 17.75,21.1 18.5,21.1 18.7,21.3 24,21.3 25.6,19.7 25.7,19.6 25.7,16.3 26.29,15.71 IC1.26
PCH6  (via drill 0.35)
  Top 0.152: IC3.1 21.65,39.25 v22.2,38.7 | R28.1 12.9,28.47 U7.3 13.77,27.6 15.2,27.6 15.95,26.85 16.6,26.85 17.8,28.05 v17.8,28.15
  Bottom 0.152: v22.2,38.7 24.5,36.4 24.5,30.1 23.1,28.7 18.85,28.7 18.3,28.15 v17.8,28.15
PCH_1
  Top 0.152: IC1.32 20.8,14 16.9,14 16.65,14.25 16.65,15.05 15.8,15.9 14.43,15.9 13.07,17.25 R30.2 13.07,17.95 13.03,18 13.03,17.98
PCH_3  (via drill 0.35)
  Top 0.152: v8.2,43.3 8.2,43.2 8.8,42.6 9.9,42.6 12.25,40.25 12.25,37.1 R8.2 | v2.5,43.6 2.5,47.02 U$1.1:SIGNAL3
  Bottom 0.152: v8.2,43.3 2.8,43.3 v2.5,43.6
PH1-328
  Top 0.152: IC1.23 28.5,12.7 29.1,12.7 30.6,14.2 30.6,18.4 26.3,22.7 21.3,22.7 20.8,23.2 15.1,23.2 13.8,24.5 4.8,24.5 3.8,25.5 3.8,31.2 5.72,33.12 T5.4
PH2_328
  Top 0.152: IC1.24 28.8,13.8 29.4,13.8 30.1,14.5 30.1,17.9 25.8,22.2 24.6,22.2 24.4,22 20.8,22 20.15,22.65 14.85,22.65 13.6,23.9 4.2,23.9 3.1,25 3.1,31.4 4.6,32.9 4.6,34.4 5.27,35.07 T5.6
RCH1  (via drill 0.35)
  Top 0.152: IC3.4 19.7,41.8 v20.05,42.15
  Bottom 0.152: v20.05,42.15 20.05,46.4 24.52,50.87 R20.1
RCH2  (via drill 0.35)
  Top 0.152: v17.7,43 17.75,42.95 IC3.7
  Bottom 0.152: R21.1 33.28,50.62 30.7,53.2 22.4,53.2 17.7,48.5 v17.7,43
SCL  (via drill 0.35)
  Top 0.152: v23.8,12.8 24.69,13.69 IC1.28 | IC2.5 37,14.24 37,20.6 v36.8,20.8
  Bottom 0.152: IC4.26 13.72,23.5 34.1,23.5 v36.8,20.8 46.2,20.8 46.3,20.7 50.8,20.7 51,20.9 58.35,20.9 59.5,22.05 62.2,22.05 62.55,22.4 65.65,22.4 66.15,21.9 JP1.2 66.15,21.35 67.2,22.4 72.2,22.4 77.6,17 77.6,11.7 76.8,10.9 I2C.SCL | v23.8,12.8 23.8,11.5 23.4,11.1 23.4,10.7 24.1,10 24.1,7.7 25.1,6.7 37.8,6.7 38.49,7.39 R22.1 39,9.41 39,10.8 38.21,11.59 IC2.5
SCLK
  Bottom 0.152: R39.1 59.77,11.12 61.07,12.42 IC2.23
SDA  (via drill 0.35)
  Top 0.152: v25.5,13.1 v25.49,13.11 IC1.27 | v33.4,21.9 34.4,20.9 34.4,14.2 35.56,13.04 35.6,13.04 | 35.6,13.04 IC2.3 | 35.6,13.04 35.6,13 37,11.6 38.9,11.6 39.5,12.2 39.5,17.4 41.1,19 50.5,19 51.5,18 68.7,18 v69.45,18.75
  Bottom 0.152: v25.5,13.1 25.8,12.8 25.8,11.5 28.05,9.25 31.9,9.25 32.45,9.8 | IC2.3 35.67,12.87 34.2,11.4 33.6,11.4 32.7,10.5 32.7,10.05 32.45,9.8 | IC4.27 13.81,22.76 32.54,22.76 v33.4,21.9 | R23.1 34.81,9.19 34.8,9.2 34.2,9.2 33.8,8.8 33.45,8.8 32.45,9.8 | v69.45,18.75 70.55,19.85 JP2.2 71.8,20.85 72.05,20.6 72.05,19.05 73.27,17.83 74.17,17.83 75.05,16.95 75.05,11.75 74.8,11.5 I2C.SDA

### Text on the board
tPlace: 3 | 2 | 1 | ST | TH | NC | NC | VCC | VCC | VCC | VCC | VCC | SIGNAL | SIGNAL | SIGNAL | SIGNAL | SIGNAL | #612 | Rev 2.0.27 | 1 | ICSP | D | RC | Jetson | D | J
bPlace: S/N | OUTLET | GND | B | Rev 2.0.27 | F-612-2-27-A-N-J-1-P
Document: #612 JetRacer Rev 2.0.27 / 2023/02/10